# Altium project CycloneMonitor.PrjPCB (part 1 of 2)
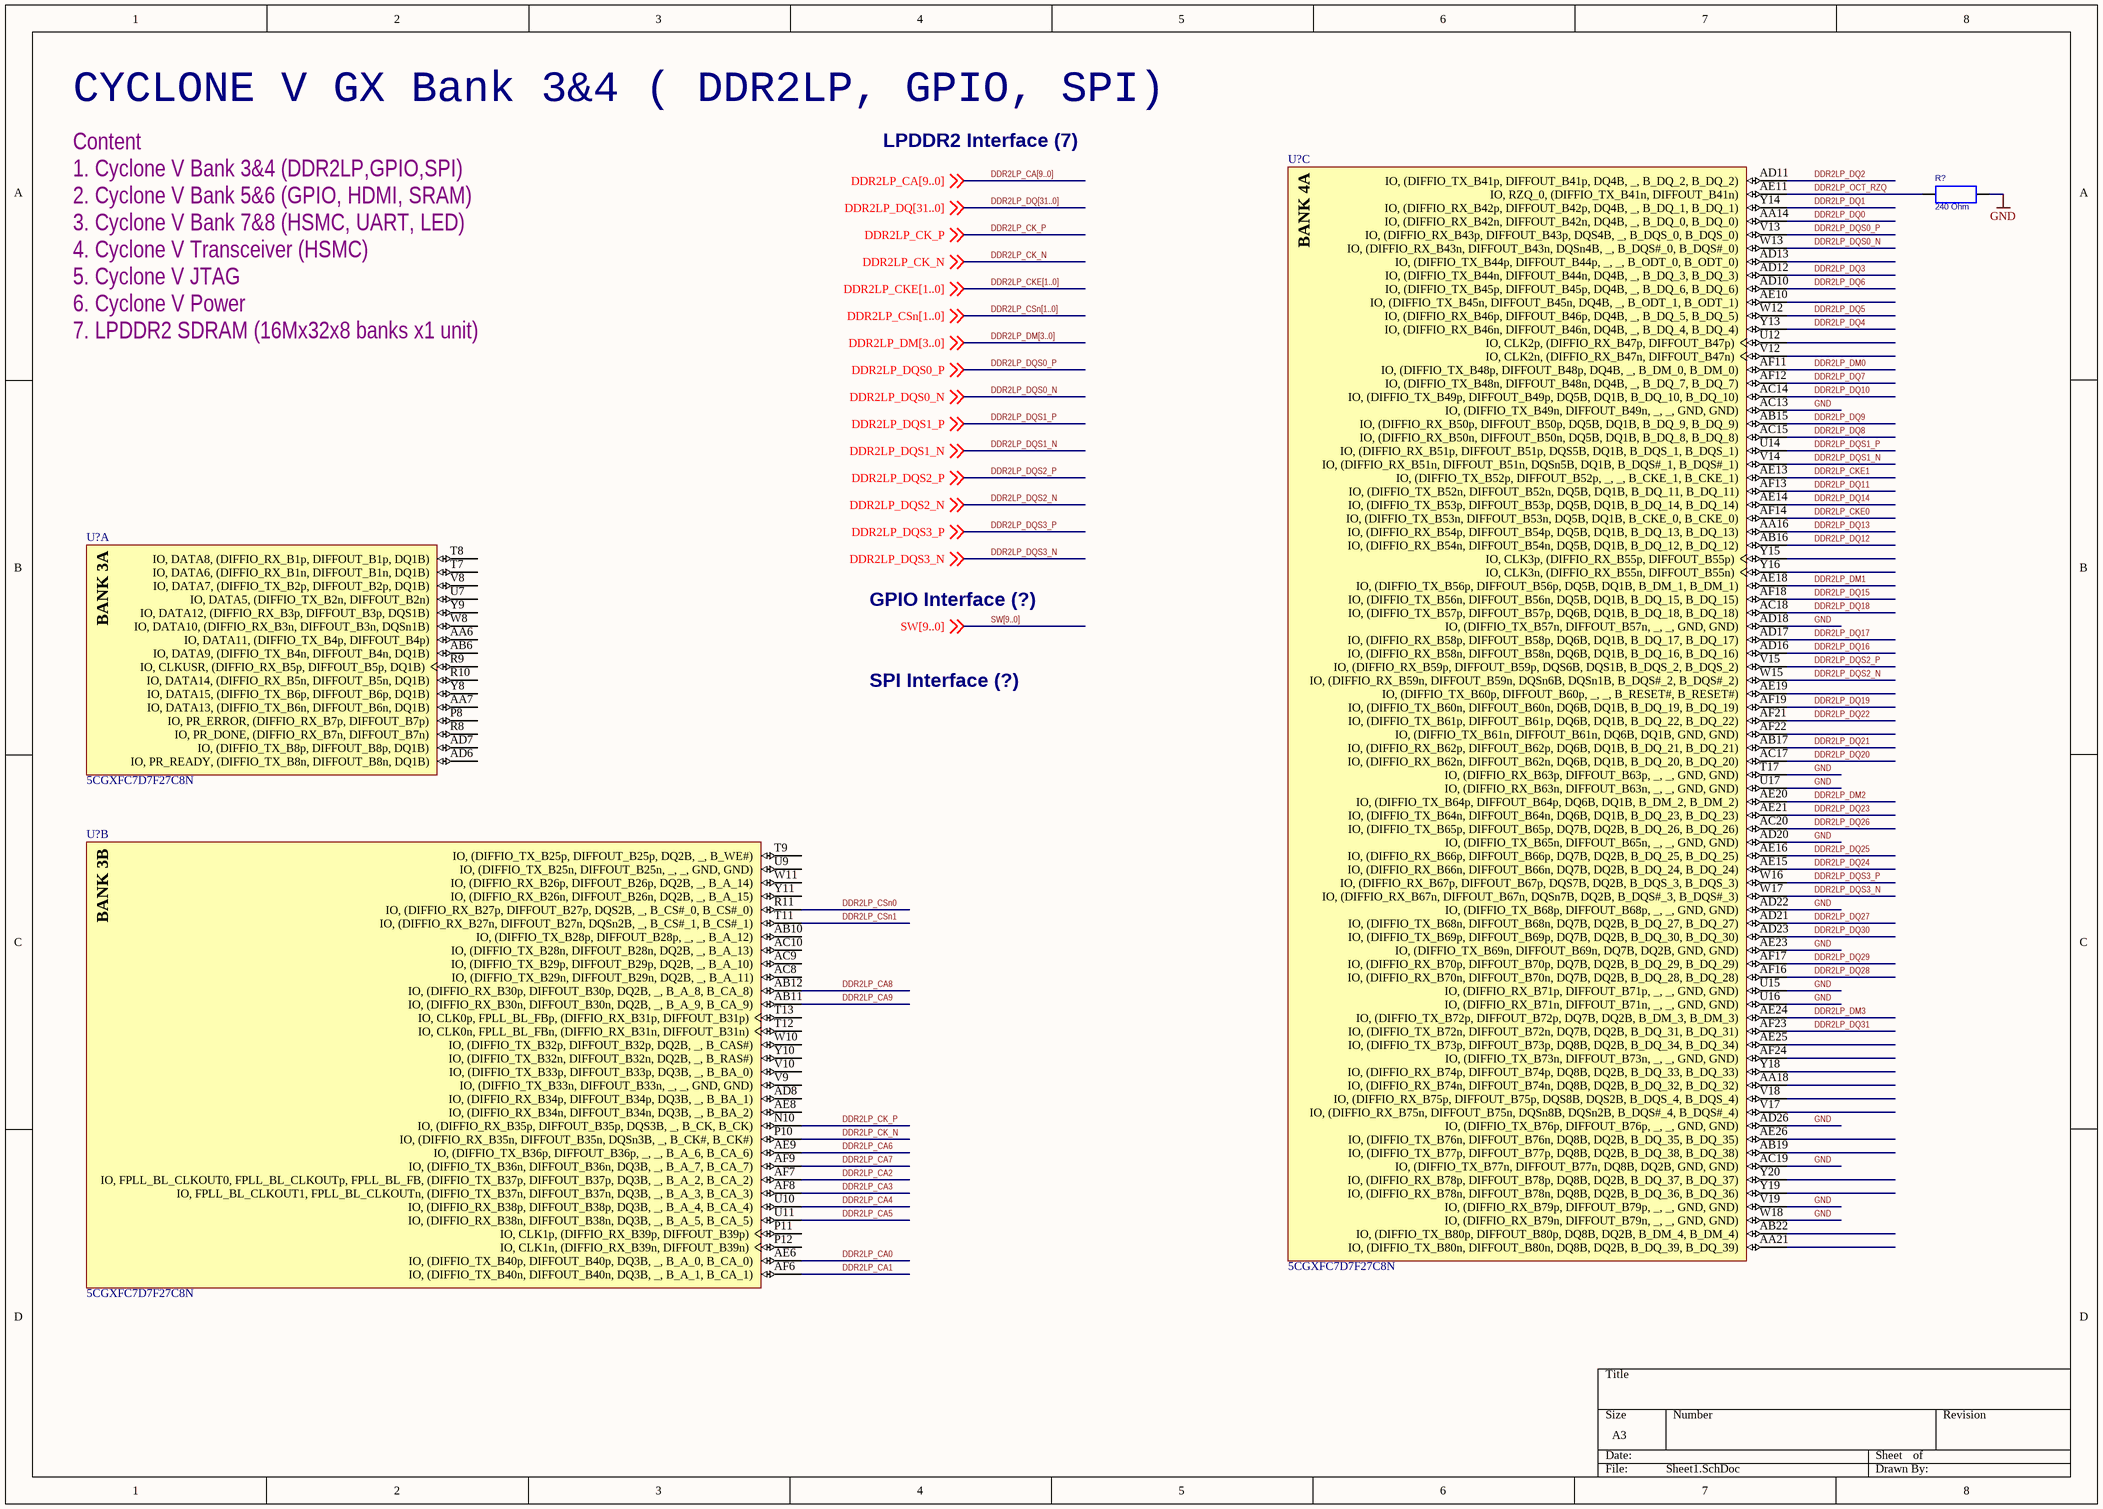
[diagram p0: Sheet1.SchDoc]
7 sheets, 89 parts. Net scope: global (net labels, ports and power ports of the same name join across sheets).
Sheets:
  Sheet1.SchDoc
  Sheet2.SchDoc
  Sheet3.SchDoc
  Sheet4.SchDoc
  Sheet5.SchDoc
  Sheet6.SchDoc
  Sheet7.SchDoc

## Sheet Sheet1.SchDoc
size A3

### Parts
(Parts that share a designator on the sheet are numbered #1, #2 ... from top to bottom, then left to right.)
R?#1  240 Ohm  [RESC1608N]
U?#1  5CGXFC7D7F27C8N  [ALTR-672-FBGA-2000A]  (part C of 15)
U?#2  5CGXFC7D7F27C8N  [ALTR-672-FBGA-2000A]  (part A of 15)
U?#3  5CGXFC7D7F27C8N  [ALTR-672-FBGA-2000A]  (part B of 15)

### Nets
GND: R?#1.2 U?#1.AC13(IO,_(DIFFIO_TX_B49n,_DIFFOUT_B49n,__,__,_GND,_GND)) U?#1.AC19(IO,_(DIFFIO_TX_B77n,_DIFFOUT_B77n,_DQ8B,_DQ2B,_GND,_GND)) U?#1.AD18(IO,_(DIFFIO_TX_B57n,_DIFFOUT_B57n,__,__,_GND,_GND)) U?#1.AD20(IO,_(DIFFIO_TX_B65n,_DIFFOUT_B65n,__,__,_GND,_GND)) U?#1.AD22(IO,_(DIFFIO_TX_B68p,_DIFFOUT_B68p,__,__,_GND,_GND)) U?#1.AD26(IO,_(DIFFIO_TX_B76p,_DIFFOUT_B76p,__,__,_GND,_GND)) U?#1.AE23(IO,_(DIFFIO_TX_B69n,_DIFFOUT_B69n,_DQ7B,_DQ2B,_GND,_GND)) U?#1.T17(IO,_(DIFFIO_RX_B63p,_DIFFOUT_B63p,__,__,_GND,_GND)) U?#1.U15(IO,_(DIFFIO_RX_B71p,_DIFFOUT_B71p,__,__,_GND,_GND)) U?#1.U16(IO,_(DIFFIO_RX_B71n,_DIFFOUT_B71n,__,__,_GND,_GND)) U?#1.U17(IO,_(DIFFIO_RX_B63n,_DIFFOUT_B63n,__,__,_GND,_GND)) U?#1.V19(IO,_(DIFFIO_RX_B79p,_DIFFOUT_B79p,__,__,_GND,_GND)) U?#1.W18(IO,_(DIFFIO_RX_B79n,_DIFFOUT_B79n,__,__,_GND,_GND))
DDR2LP_CA0: U?#3.AE6(IO,_(DIFFIO_TX_B40p,_DIFFOUT_B40p,_DQ3B,__,_B_A_0,_B_CA_0))
DDR2LP_CA1: U?#3.AF6(IO,_(DIFFIO_TX_B40n,_DIFFOUT_B40n,_DQ3B,__,_B_A_1,_B_CA_1))
DDR2LP_CA2: U?#3.AF7(IO,_FPLL_BL_CLKOUT0,_FPLL_BL_CLKOUTp,_FPLL_BL_FB,_(DIFFIO_TX_B37p,_DIFFOUT_B37p,_DQ3B,__,_B_A_2,_B_CA_2))
DDR2LP_CA3: U?#3.AF8(IO,_FPLL_BL_CLKOUT1,_FPLL_BL_CLKOUTn,_(DIFFIO_TX_B37n,_DIFFOUT_B37n,_DQ3B,__,_B_A_3,_B_CA_3))
DDR2LP_CA4: U?#3.U10(IO,_(DIFFIO_RX_B38p,_DIFFOUT_B38p,_DQ3B,__,_B_A_4,_B_CA_4))
DDR2LP_CA5: U?#3.U11(IO,_(DIFFIO_RX_B38n,_DIFFOUT_B38n,_DQ3B,__,_B_A_5,_B_CA_5))
DDR2LP_CA6: U?#3.AE9(IO,_(DIFFIO_TX_B36p,_DIFFOUT_B36p,__,__,_B_A_6,_B_CA_6))
DDR2LP_CA7: U?#3.AF9(IO,_(DIFFIO_TX_B36n,_DIFFOUT_B36n,_DQ3B,__,_B_A_7,_B_CA_7))
DDR2LP_CA8: U?#3.AB12(IO,_(DIFFIO_RX_B30p,_DIFFOUT_B30p,_DQ2B,__,_B_A_8,_B_CA_8))
DDR2LP_CA9: U?#3.AB11(IO,_(DIFFIO_RX_B30n,_DIFFOUT_B30n,_DQ2B,__,_B_A_9,_B_CA_9))
DDR2LP_CK_N: U?#3.P10(IO,_(DIFFIO_RX_B35n,_DIFFOUT_B35n,_DQSn3B,__,_B_CK#,_B_CK#)) ; off-sheet DDR2LP_CK_N
DDR2LP_CK_P: U?#3.N10(IO,_(DIFFIO_RX_B35p,_DIFFOUT_B35p,_DQS3B,__,_B_CK,_B_CK)) ; off-sheet DDR2LP_CK_P
DDR2LP_CKE0: U?#1.AF14(IO,_(DIFFIO_TX_B53n,_DIFFOUT_B53n,_DQ5B,_DQ1B,_B_CKE_0,_B_CKE_0))
DDR2LP_CKE1: U?#1.AE13(IO,_(DIFFIO_TX_B52p,_DIFFOUT_B52p,__,__,_B_CKE_1,_B_CKE_1))
DDR2LP_CSn0: U?#3.R11(IO,_(DIFFIO_RX_B27p,_DIFFOUT_B27p,_DQS2B,__,_B_CS#_0,_B_CS#_0))
DDR2LP_CSn1: U?#3.T11(IO,_(DIFFIO_RX_B27n,_DIFFOUT_B27n,_DQSn2B,__,_B_CS#_1,_B_CS#_1))
DDR2LP_DM0: U?#1.AF11(IO,_(DIFFIO_TX_B48p,_DIFFOUT_B48p,_DQ4B,__,_B_DM_0,_B_DM_0))
DDR2LP_DM1: U?#1.AE18(IO,_(DIFFIO_TX_B56p,_DIFFOUT_B56p,_DQ5B,_DQ1B,_B_DM_1,_B_DM_1))
DDR2LP_DM2: U?#1.AE20(IO,_(DIFFIO_TX_B64p,_DIFFOUT_B64p,_DQ6B,_DQ1B,_B_DM_2,_B_DM_2))
DDR2LP_DM3: U?#1.AE24(IO,_(DIFFIO_TX_B72p,_DIFFOUT_B72p,_DQ7B,_DQ2B,_B_DM_3,_B_DM_3))
DDR2LP_DQ0: U?#1.AA14(IO,_(DIFFIO_RX_B42n,_DIFFOUT_B42n,_DQ4B,__,_B_DQ_0,_B_DQ_0))
DDR2LP_DQ1: U?#1.Y14(IO,_(DIFFIO_RX_B42p,_DIFFOUT_B42p,_DQ4B,__,_B_DQ_1,_B_DQ_1))
DDR2LP_DQ2: U?#1.AD11(IO,_(DIFFIO_TX_B41p,_DIFFOUT_B41p,_DQ4B,__,_B_DQ_2,_B_DQ_2))
DDR2LP_DQ3: U?#1.AD12(IO,_(DIFFIO_TX_B44n,_DIFFOUT_B44n,_DQ4B,__,_B_DQ_3,_B_DQ_3))
DDR2LP_DQ4: U?#1.Y13(IO,_(DIFFIO_RX_B46n,_DIFFOUT_B46n,_DQ4B,__,_B_DQ_4,_B_DQ_4))
DDR2LP_DQ5: U?#1.W12(IO,_(DIFFIO_RX_B46p,_DIFFOUT_B46p,_DQ4B,__,_B_DQ_5,_B_DQ_5))
DDR2LP_DQ6: U?#1.AD10(IO,_(DIFFIO_TX_B45p,_DIFFOUT_B45p,_DQ4B,__,_B_DQ_6,_B_DQ_6))
DDR2LP_DQ7: U?#1.AF12(IO,_(DIFFIO_TX_B48n,_DIFFOUT_B48n,_DQ4B,__,_B_DQ_7,_B_DQ_7))
DDR2LP_DQ8: U?#1.AC15(IO,_(DIFFIO_RX_B50n,_DIFFOUT_B50n,_DQ5B,_DQ1B,_B_DQ_8,_B_DQ_8))
DDR2LP_DQ9: U?#1.AB15(IO,_(DIFFIO_RX_B50p,_DIFFOUT_B50p,_DQ5B,_DQ1B,_B_DQ_9,_B_DQ_9))
DDR2LP_DQ10: U?#1.AC14(IO,_(DIFFIO_TX_B49p,_DIFFOUT_B49p,_DQ5B,_DQ1B,_B_DQ_10,_B_DQ_10))
DDR2LP_DQ11: U?#1.AF13(IO,_(DIFFIO_TX_B52n,_DIFFOUT_B52n,_DQ5B,_DQ1B,_B_DQ_11,_B_DQ_11))
DDR2LP_DQ12: U?#1.AB16(IO,_(DIFFIO_RX_B54n,_DIFFOUT_B54n,_DQ5B,_DQ1B,_B_DQ_12,_B_DQ_12))
DDR2LP_DQ13: U?#1.AA16(IO,_(DIFFIO_RX_B54p,_DIFFOUT_B54p,_DQ5B,_DQ1B,_B_DQ_13,_B_DQ_13))
DDR2LP_DQ14: U?#1.AE14(IO,_(DIFFIO_TX_B53p,_DIFFOUT_B53p,_DQ5B,_DQ1B,_B_DQ_14,_B_DQ_14))
DDR2LP_DQ15: U?#1.AF18(IO,_(DIFFIO_TX_B56n,_DIFFOUT_B56n,_DQ5B,_DQ1B,_B_DQ_15,_B_DQ_15))
DDR2LP_DQ16: U?#1.AD16(IO,_(DIFFIO_RX_B58n,_DIFFOUT_B58n,_DQ6B,_DQ1B,_B_DQ_16,_B_DQ_16))
DDR2LP_DQ17: U?#1.AD17(IO,_(DIFFIO_RX_B58p,_DIFFOUT_B58p,_DQ6B,_DQ1B,_B_DQ_17,_B_DQ_17))
DDR2LP_DQ18: U?#1.AC18(IO,_(DIFFIO_TX_B57p,_DIFFOUT_B57p,_DQ6B,_DQ1B,_B_DQ_18,_B_DQ_18))
DDR2LP_DQ19: U?#1.AF19(IO,_(DIFFIO_TX_B60n,_DIFFOUT_B60n,_DQ6B,_DQ1B,_B_DQ_19,_B_DQ_19))
DDR2LP_DQ20: U?#1.AC17(IO,_(DIFFIO_RX_B62n,_DIFFOUT_B62n,_DQ6B,_DQ1B,_B_DQ_20,_B_DQ_20))
DDR2LP_DQ21: U?#1.AB17(IO,_(DIFFIO_RX_B62p,_DIFFOUT_B62p,_DQ6B,_DQ1B,_B_DQ_21,_B_DQ_21))
DDR2LP_DQ22: U?#1.AF21(IO,_(DIFFIO_TX_B61p,_DIFFOUT_B61p,_DQ6B,_DQ1B,_B_DQ_22,_B_DQ_22))
DDR2LP_DQ23: U?#1.AE21(IO,_(DIFFIO_TX_B64n,_DIFFOUT_B64n,_DQ6B,_DQ1B,_B_DQ_23,_B_DQ_23))
DDR2LP_DQ24: U?#1.AE15(IO,_(DIFFIO_RX_B66n,_DIFFOUT_B66n,_DQ7B,_DQ2B,_B_DQ_24,_B_DQ_24))
DDR2LP_DQ25: U?#1.AE16(IO,_(DIFFIO_RX_B66p,_DIFFOUT_B66p,_DQ7B,_DQ2B,_B_DQ_25,_B_DQ_25))
DDR2LP_DQ26: U?#1.AC20(IO,_(DIFFIO_TX_B65p,_DIFFOUT_B65p,_DQ7B,_DQ2B,_B_DQ_26,_B_DQ_26))
DDR2LP_DQ27: U?#1.AD21(IO,_(DIFFIO_TX_B68n,_DIFFOUT_B68n,_DQ7B,_DQ2B,_B_DQ_27,_B_DQ_27))
DDR2LP_DQ28: U?#1.AF16(IO,_(DIFFIO_RX_B70n,_DIFFOUT_B70n,_DQ7B,_DQ2B,_B_DQ_28,_B_DQ_28))
DDR2LP_DQ29: U?#1.AF17(IO,_(DIFFIO_RX_B70p,_DIFFOUT_B70p,_DQ7B,_DQ2B,_B_DQ_29,_B_DQ_29))
DDR2LP_DQ30: U?#1.AD23(IO,_(DIFFIO_TX_B69p,_DIFFOUT_B69p,_DQ7B,_DQ2B,_B_DQ_30,_B_DQ_30))
DDR2LP_DQ31: U?#1.AF23(IO,_(DIFFIO_TX_B72n,_DIFFOUT_B72n,_DQ7B,_DQ2B,_B_DQ_31,_B_DQ_31))
DDR2LP_DQS0_N: U?#1.W13(IO,_(DIFFIO_RX_B43n,_DIFFOUT_B43n,_DQSn4B,__,_B_DQS#_0,_B_DQS#_0)) ; off-sheet DDR2LP_DQS0_N
DDR2LP_DQS0_P: U?#1.V13(IO,_(DIFFIO_RX_B43p,_DIFFOUT_B43p,_DQS4B,__,_B_DQS_0,_B_DQS_0)) ; off-sheet DDR2LP_DQS0_P
DDR2LP_DQS1_N: U?#1.V14(IO,_(DIFFIO_RX_B51n,_DIFFOUT_B51n,_DQSn5B,_DQ1B,_B_DQS#_1,_B_DQS#_1)) ; off-sheet DDR2LP_DQS1_N
DDR2LP_DQS1_P: U?#1.U14(IO,_(DIFFIO_RX_B51p,_DIFFOUT_B51p,_DQS5B,_DQ1B,_B_DQS_1,_B_DQS_1)) ; off-sheet DDR2LP_DQS1_P
DDR2LP_DQS2_N: U?#1.W15(IO,_(DIFFIO_RX_B59n,_DIFFOUT_B59n,_DQSn6B,_DQSn1B,_B_DQS#_2,_B_DQS#_2)) ; off-sheet DDR2LP_DQS2_N
DDR2LP_DQS2_P: U?#1.V15(IO,_(DIFFIO_RX_B59p,_DIFFOUT_B59p,_DQS6B,_DQS1B,_B_DQS_2,_B_DQS_2)) ; off-sheet DDR2LP_DQS2_P
DDR2LP_DQS3_N: U?#1.W17(IO,_(DIFFIO_RX_B67n,_DIFFOUT_B67n,_DQSn7B,_DQ2B,_B_DQS#_3,_B_DQS#_3)) ; off-sheet DDR2LP_DQS3_N
DDR2LP_DQS3_P: U?#1.W16(IO,_(DIFFIO_RX_B67p,_DIFFOUT_B67p,_DQS7B,_DQ2B,_B_DQS_3,_B_DQS_3)) ; off-sheet DDR2LP_DQS3_P
DDR2LP_OCT_RZQ: R?#1.1 U?#1.AE11(IO,_RZQ_0,_(DIFFIO_TX_B41n,_DIFFOUT_B41n))

Not connected (* = marked no-connect by the designer): U?#1 AA18(IO,_(DIFFIO_RX_B74n,_DIFFOUT_B74n,_DQ8B,_DQ2B,_B_DQ_32,_B_DQ_32)) AA21(IO,_(DIFFIO_TX_B80n,_DIFFOUT_B80n,_DQ8B,_DQ2B,_B_DQ_39,_B_DQ_39)) AB19(IO,_(DIFFIO_TX_B77p,_DIFFOUT_B77p,_DQ8B,_DQ2B,_B_DQ_38,_B_DQ_38)) AB22(IO,_(DIFFIO_TX_B80p,_DIFFOUT_B80p,_DQ8B,_DQ2B,_B_DM_4,_B_DM_4)) AD13(IO,_(DIFFIO_TX_B44p,_DIFFOUT_B44p,__,__,_B_ODT_0,_B_ODT_0)) AE10(IO,_(DIFFIO_TX_B45n,_DIFFOUT_B45n,_DQ4B,__,_B_ODT_1,_B_ODT_1)) AE19(IO,_(DIFFIO_TX_B60p,_DIFFOUT_B60p,__,__,_B_RESET#,_B_RESET#)) AE25(IO,_(DIFFIO_TX_B73p,_DIFFOUT_B73p,_DQ8B,_DQ2B,_B_DQ_34,_B_DQ_34)) AE26(IO,_(DIFFIO_TX_B76n,_DIFFOUT_B76n,_DQ8B,_DQ2B,_B_DQ_35,_B_DQ_35)) AF22(IO,_(DIFFIO_TX_B61n,_DIFFOUT_B61n,_DQ6B,_DQ1B,_GND,_GND)) AF24(IO,_(DIFFIO_TX_B73n,_DIFFOUT_B73n,__,__,_GND,_GND)) U12(IO,_CLK2p,_(DIFFIO_RX_B47p,_DIFFOUT_B47p)) V12(IO,_CLK2n,_(DIFFIO_RX_B47n,_DIFFOUT_B47n)) V17(IO,_(DIFFIO_RX_B75n,_DIFFOUT_B75n,_DQSn8B,_DQSn2B,_B_DQS#_4,_B_DQS#_4)) V18(IO,_(DIFFIO_RX_B75p,_DIFFOUT_B75p,_DQS8B,_DQS2B,_B_DQS_4,_B_DQS_4)) Y15(IO,_CLK3p,_(DIFFIO_RX_B55p,_DIFFOUT_B55p)) Y16(IO,_CLK3n,_(DIFFIO_RX_B55n,_DIFFOUT_B55n)) Y18(IO,_(DIFFIO_RX_B74p,_DIFFOUT_B74p,_DQ8B,_DQ2B,_B_DQ_33,_B_DQ_33)) Y19(IO,_(DIFFIO_RX_B78n,_DIFFOUT_B78n,_DQ8B,_DQ2B,_B_DQ_36,_B_DQ_36)) Y20(IO,_(DIFFIO_RX_B78p,_DIFFOUT_B78p,_DQ8B,_DQ2B,_B_DQ_37,_B_DQ_37)); U?#2 AA6(IO,_DATA11,_(DIFFIO_TX_B4p,_DIFFOUT_B4p)) AA7(IO,_DATA13,_(DIFFIO_TX_B6n,_DIFFOUT_B6n,_DQ1B)) AB6(IO,_DATA9,_(DIFFIO_TX_B4n,_DIFFOUT_B4n,_DQ1B)) AD6(IO,_PR_READY,_(DIFFIO_TX_B8n,_DIFFOUT_B8n,_DQ1B)) AD7(IO,_(DIFFIO_TX_B8p,_DIFFOUT_B8p,_DQ1B)) P8(IO,_PR_ERROR,_(DIFFIO_RX_B7p,_DIFFOUT_B7p)) R8(IO,_PR_DONE,_(DIFFIO_RX_B7n,_DIFFOUT_B7n)) R9(IO,_CLKUSR,_(DIFFIO_RX_B5p,_DIFFOUT_B5p,_DQ1B)) R10(IO,_DATA14,_(DIFFIO_RX_B5n,_DIFFOUT_B5n,_DQ1B)) T7(IO,_DATA6,_(DIFFIO_RX_B1n,_DIFFOUT_B1n,_DQ1B)) T8(IO,_DATA8,_(DIFFIO_RX_B1p,_DIFFOUT_B1p,_DQ1B)) U7(IO,_DATA5,_(DIFFIO_TX_B2n,_DIFFOUT_B2n)) V8(IO,_DATA7,_(DIFFIO_TX_B2p,_DIFFOUT_B2p,_DQ1B)) W8(IO,_DATA10,_(DIFFIO_RX_B3n,_DIFFOUT_B3n,_DQSn1B)) Y8(IO,_DATA15,_(DIFFIO_TX_B6p,_DIFFOUT_B6p,_DQ1B)) Y9(IO,_DATA12,_(DIFFIO_RX_B3p,_DIFFOUT_B3p,_DQS1B)); U?#3 AB10(IO,_(DIFFIO_TX_B28p,_DIFFOUT_B28p,__,__,_B_A_12)) AC8(IO,_(DIFFIO_TX_B29n,_DIFFOUT_B29n,_DQ2B,__,_B_A_11)) AC9(IO,_(DIFFIO_TX_B29p,_DIFFOUT_B29p,_DQ2B,__,_B_A_10)) AC10(IO,_(DIFFIO_TX_B28n,_DIFFOUT_B28n,_DQ2B,__,_B_A_13)) AD8(IO,_(DIFFIO_RX_B34p,_DIFFOUT_B34p,_DQ3B,__,_B_BA_1)) AE8(IO,_(DIFFIO_RX_B34n,_DIFFOUT_B34n,_DQ3B,__,_B_BA_2)) P11(IO,_CLK1p,_(DIFFIO_RX_B39p,_DIFFOUT_B39p)) P12(IO,_CLK1n,_(DIFFIO_RX_B39n,_DIFFOUT_B39n)) T9(IO,_(DIFFIO_TX_B25p,_DIFFOUT_B25p,_DQ2B,__,_B_WE#)) T12(IO,_CLK0n,_FPLL_BL_FBn,_(DIFFIO_RX_B31n,_DIFFOUT_B31n)) T13(IO,_CLK0p,_FPLL_BL_FBp,_(DIFFIO_RX_B31p,_DIFFOUT_B31p)) U9(IO,_(DIFFIO_TX_B25n,_DIFFOUT_B25n,__,__,_GND,_GND)) V9(IO,_(DIFFIO_TX_B33n,_DIFFOUT_B33n,__,__,_GND,_GND)) V10(IO,_(DIFFIO_TX_B33p,_DIFFOUT_B33p,_DQ3B,__,_B_BA_0)) W10(IO,_(DIFFIO_TX_B32p,_DIFFOUT_B32p,_DQ2B,__,_B_CAS#)) W11(IO,_(DIFFIO_RX_B26p,_DIFFOUT_B26p,_DQ2B,__,_B_A_14)) Y10(IO,_(DIFFIO_TX_B32n,_DIFFOUT_B32n,_DQ2B,__,_B_RAS#)) Y11(IO,_(DIFFIO_RX_B26n,_DIFFOUT_B26n,_DQ2B,__,_B_A_15))

### Buses and harness runs
bus DDR2LP_CA[9..0]
bus DDR2LP_CKE[1..0]
bus DDR2LP_CSn[1..0]
bus DDR2LP_DM[3..0]
bus DDR2LP_DQ[31..0]
bus SW[9..0]

### Notes on the sheet
- CYCLONE V GX Bank 3&4 ( DDR2LP, GPIO, SPI)
- LPDDR2 Interface (7)
- (near U?#2) Content
  1. Cyclone V Bank 3&4 (DDR2LP,GPIO,SPI)
  2. Cyclone V Bank 5&6 (GPIO, HDMI, SRAM)
  3. Cyclone V Bank 7&8 (HSMC, UART, LED)
  4. Cyclone V Transceiver (HSMC)
  5. Cyclone V JTAG
  6. Cyclone V Power
  7. LPDDR2 SDRAM (16Mx32x8 banks x1 unit)
- GPIO Interface (?)
- SPI Interface (?)
- (in symbol 5CGXFC7D7F27C8N, part A) BANK 3A
- (in symbol 5CGXFC7D7F27C8N, part B) BANK 3B
- (in symbol 5CGXFC7D7F27C8N, part C) BANK 4A

### Library data of the parts
R?#1 = RC0603: Oper. Temp. Range: -55C to 125C; RoHS: Yes; Package: 0603
U?#1-U?#3 = 5CGXFC7D7F27C8N: Cyclone V GX Family FPGA, 1.07 to 1.13 V Supply, 336 I/O Pins, 7 PLLs, 672-Pin FBGA, Speed Grade 8, Commercial Grade, RoHS Compliant; Manufacturer: Altera; GPIO: 336; Logic Elements (LE) (K): 149.5; Speed Grade: 8; DatasheetVersion: Rev. 3.1; PackageReference: 672-FBGA-2000A; PackageDescription: 672-Pin FineLine Ball-Grid Array (FBGA), Body 27 x 27 mm, Pitch 1 mm; Supplier 1: Digi-Key; Supplier Part Number 1: 544-2773-ND; Supplier 2: Mouser; Supplier Part Number 2: 989-5CGXFC7D7F27C8N; Device Group: 5CGXFC7; RoHS: RoHS Compliant; Subcategory: Cyclone V GX; Voltage Supply: 1.07 to 1.13 V; Mounting Technology: Surface Mount; Code_JEDEC: MS-034-AAL-1; PartNumber: 5CGXFC7D7F27C8N; ComponentLink1Description: Manufacturer URL; ComponentLink1URL: http://www.altera.com; ComponentLink2Description: Datasheet; ComponentLink2URL: http://www.altera.com/literature/hb/cyclone-v/cv_51002.pdf; ComponentLink3Description: Package Specification; ComponentLink3URL: http://www.altera.com/devicepackaging/04R00427-01.pdf; ComponentLink4Description: Device Handbook URL; ComponentLink4URL: http://www.altera.com/literature/hb/cyclone-v/cyclone5_handbook.pdf; ComponentLink5Description: Device Overview URL; ComponentLink5URL: http://www.altera.com/literature/hb/cyclone-v/cv_51001.pdf; ComponentLink6Description: Device Pin-Out URL; ComponentLink6URL: http://www.altera.com/literature/dp/cyclone-v/1.txt; ComponentLink7Description: Product URL; ComponentLink7URL: http://www.buyaltera.com/scripts/partsearch.dll?Detail&name=5CGXFC7D7F27C8N-ND

## Sheet Sheet2.SchDoc
size A3
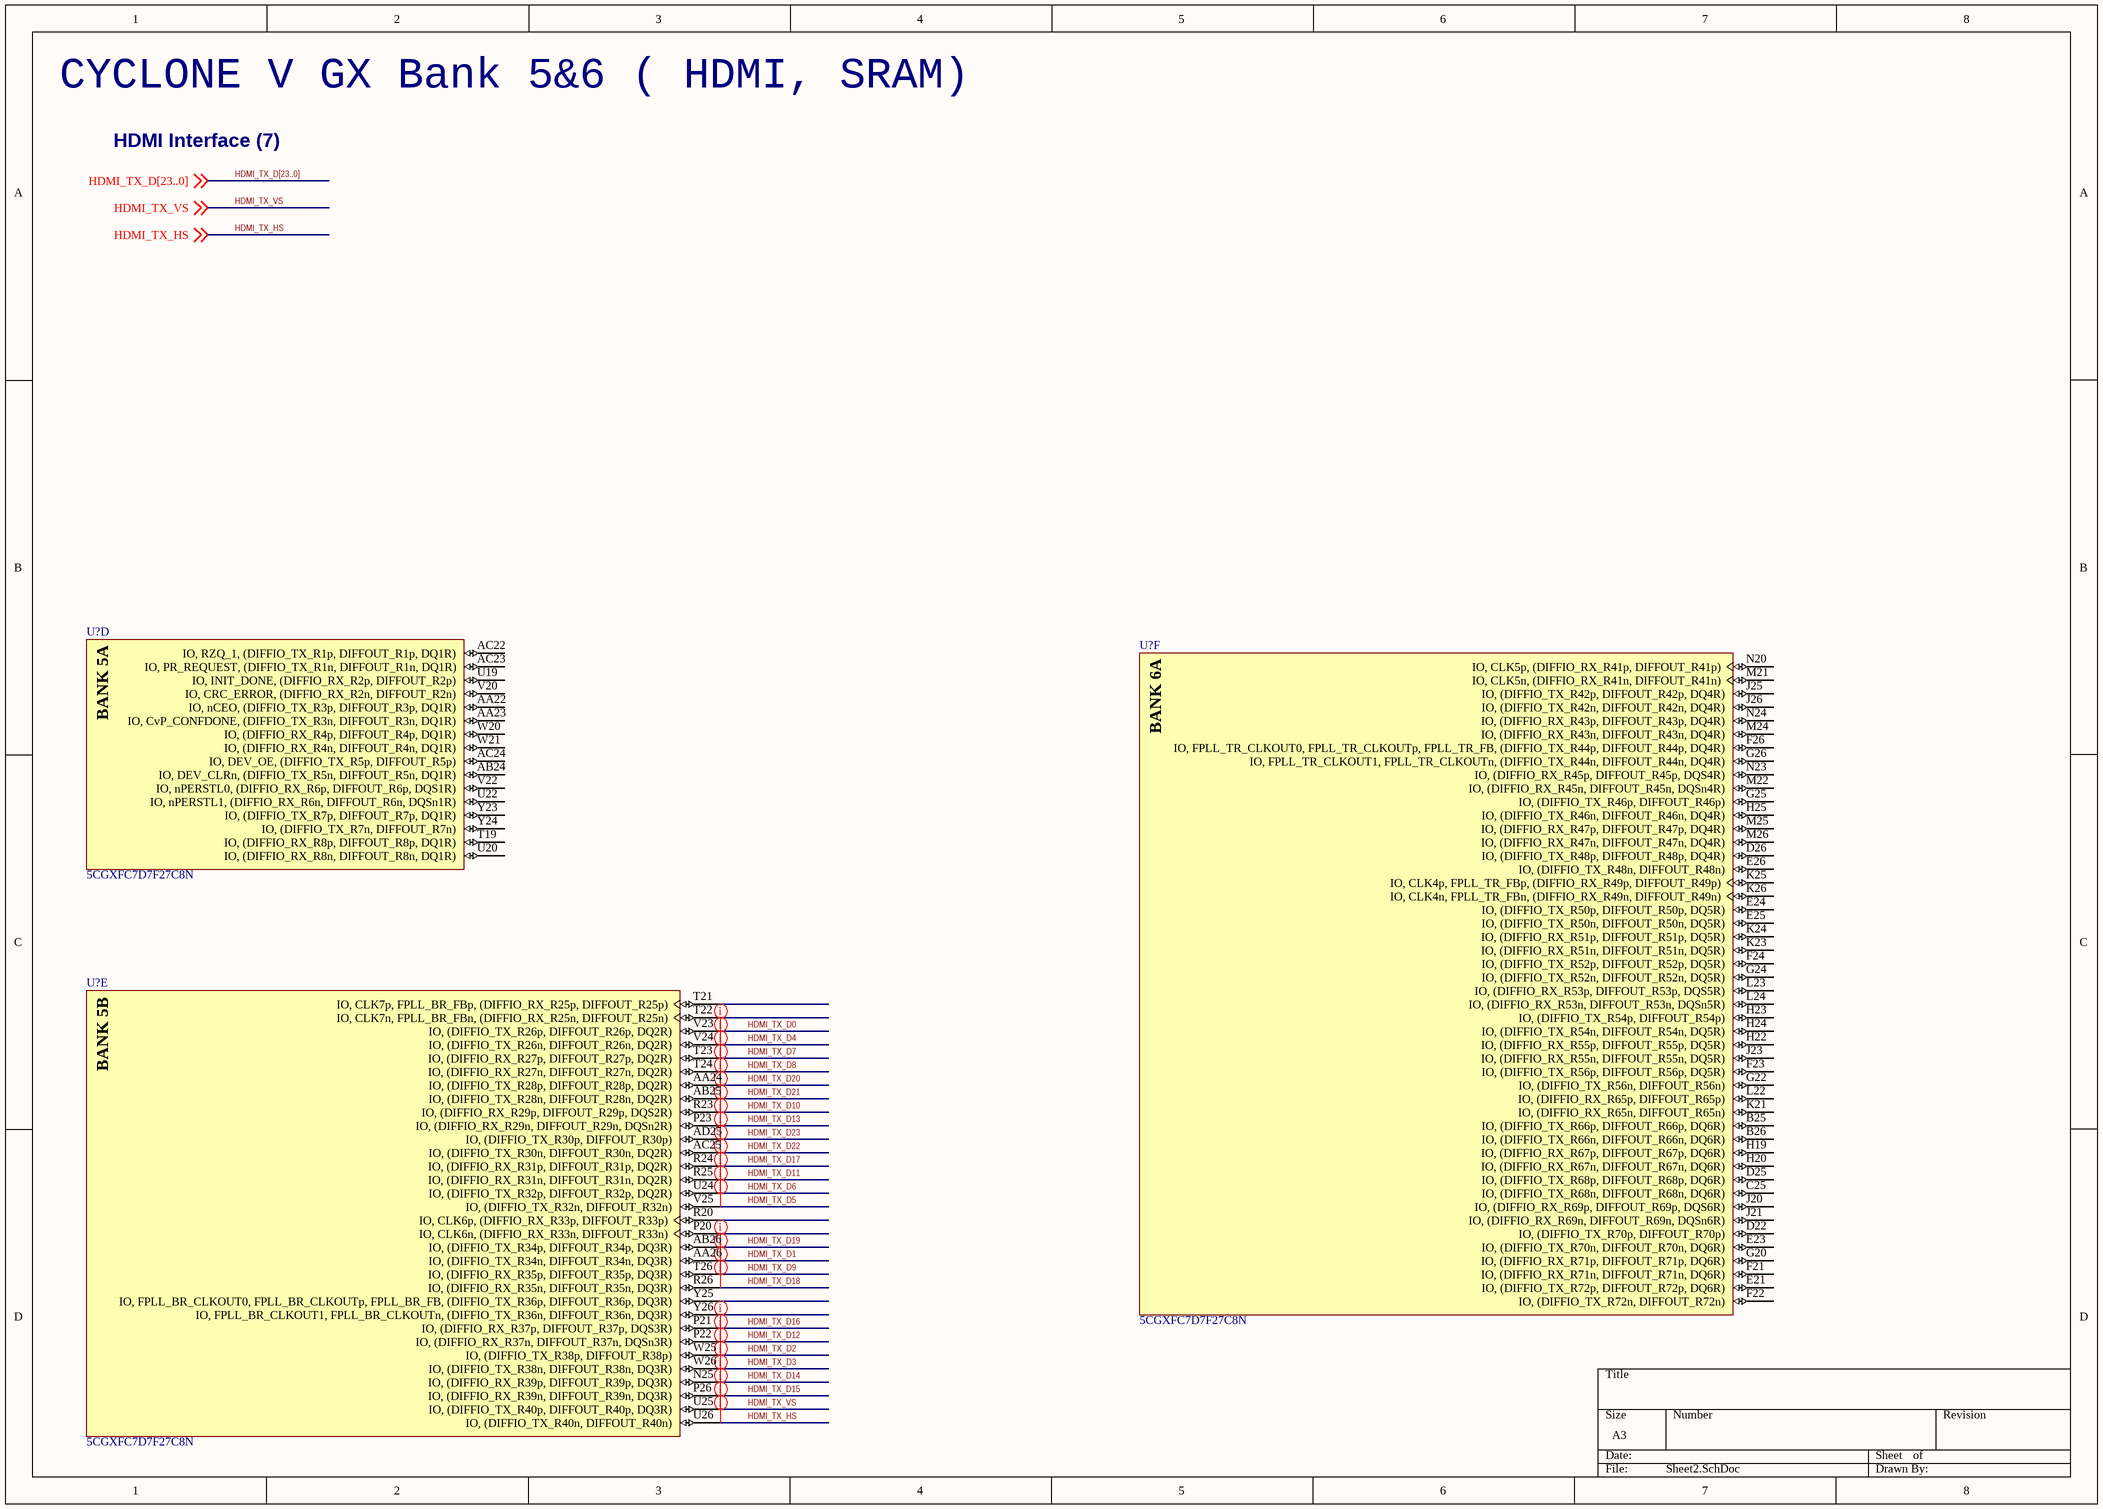
[diagram p1: Sheet2.SchDoc]

### Parts
(Parts that share a designator on the sheet are numbered #1, #2 ... from top to bottom, then left to right.)
U?#4  5CGXFC7D7F27C8N  [ALTR-672-FBGA-2000A]  (part D of 15)
U?#5  5CGXFC7D7F27C8N  [ALTR-672-FBGA-2000A]  (part F of 15)
U?#6  5CGXFC7D7F27C8N  [ALTR-672-FBGA-2000A]  (part E of 15)

### Nets
HDMI_TX_D0: U?#6.V23(IO,_(DIFFIO_TX_R26p,_DIFFOUT_R26p,_DQ2R))
HDMI_TX_D1: U?#6.AA26(IO,_(DIFFIO_TX_R34n,_DIFFOUT_R34n,_DQ3R))
HDMI_TX_D2: U?#6.W25(IO,_(DIFFIO_TX_R38p,_DIFFOUT_R38p))
HDMI_TX_D3: U?#6.W26(IO,_(DIFFIO_TX_R38n,_DIFFOUT_R38n,_DQ3R))
HDMI_TX_D4: U?#6.V24(IO,_(DIFFIO_TX_R26n,_DIFFOUT_R26n,_DQ2R))
HDMI_TX_D5: U?#6.V25(IO,_(DIFFIO_TX_R32n,_DIFFOUT_R32n))
HDMI_TX_D6: U?#6.U24(IO,_(DIFFIO_TX_R32p,_DIFFOUT_R32p,_DQ2R))
HDMI_TX_D7: U?#6.T23(IO,_(DIFFIO_RX_R27p,_DIFFOUT_R27p,_DQ2R))
HDMI_TX_D8: U?#6.T24(IO,_(DIFFIO_RX_R27n,_DIFFOUT_R27n,_DQ2R))
HDMI_TX_D9: U?#6.T26(IO,_(DIFFIO_RX_R35p,_DIFFOUT_R35p,_DQ3R))
HDMI_TX_D10: U?#6.R23(IO,_(DIFFIO_RX_R29p,_DIFFOUT_R29p,_DQS2R))
HDMI_TX_D11: U?#6.R25(IO,_(DIFFIO_RX_R31n,_DIFFOUT_R31n,_DQ2R))
HDMI_TX_D12: U?#6.P22(IO,_(DIFFIO_RX_R37n,_DIFFOUT_R37n,_DQSn3R))
HDMI_TX_D13: U?#6.P23(IO,_(DIFFIO_RX_R29n,_DIFFOUT_R29n,_DQSn2R))
HDMI_TX_D14: U?#6.N25(IO,_(DIFFIO_RX_R39p,_DIFFOUT_R39p,_DQ3R))
HDMI_TX_D15: U?#6.P26(IO,_(DIFFIO_RX_R39n,_DIFFOUT_R39n,_DQ3R))
HDMI_TX_D16: U?#6.P21(IO,_(DIFFIO_RX_R37p,_DIFFOUT_R37p,_DQS3R))
HDMI_TX_D17: U?#6.R24(IO,_(DIFFIO_RX_R31p,_DIFFOUT_R31p,_DQ2R))
HDMI_TX_D18: U?#6.R26(IO,_(DIFFIO_RX_R35n,_DIFFOUT_R35n,_DQ3R))
HDMI_TX_D19: U?#6.AB26(IO,_(DIFFIO_TX_R34p,_DIFFOUT_R34p,_DQ3R))
HDMI_TX_D20: U?#6.AA24(IO,_(DIFFIO_TX_R28p,_DIFFOUT_R28p,_DQ2R))
HDMI_TX_D21: U?#6.AB25(IO,_(DIFFIO_TX_R28n,_DIFFOUT_R28n,_DQ2R))
HDMI_TX_D22: U?#6.AC25(IO,_(DIFFIO_TX_R30n,_DIFFOUT_R30n,_DQ2R))
HDMI_TX_D23: U?#6.AD25(IO,_(DIFFIO_TX_R30p,_DIFFOUT_R30p))
HDMI_TX_HS: U?#6.U26(IO,_(DIFFIO_TX_R40n,_DIFFOUT_R40n)) ; off-sheet HDMI_TX_HS
HDMI_TX_VS: U?#6.U25(IO,_(DIFFIO_TX_R40p,_DIFFOUT_R40p,_DQ3R)) ; off-sheet HDMI_TX_VS

Not connected (* = marked no-connect by the designer): U?#4 AA22(IO,_nCEO,_(DIFFIO_TX_R3p,_DIFFOUT_R3p,_DQ1R)) AA23(IO,_CvP_CONFDONE,_(DIFFIO_TX_R3n,_DIFFOUT_R3n,_DQ1R)) AB24(IO,_DEV_CLRn,_(DIFFIO_TX_R5n,_DIFFOUT_R5n,_DQ1R)) AC22(IO,_RZQ_1,_(DIFFIO_TX_R1p,_DIFFOUT_R1p,_DQ1R)) AC23(IO,_PR_REQUEST,_(DIFFIO_TX_R1n,_DIFFOUT_R1n,_DQ1R)) AC24(IO,_DEV_OE,_(DIFFIO_TX_R5p,_DIFFOUT_R5p)) T19(IO,_(DIFFIO_RX_R8p,_DIFFOUT_R8p,_DQ1R)) U19(IO,_INIT_DONE,_(DIFFIO_RX_R2p,_DIFFOUT_R2p)) U20(IO,_(DIFFIO_RX_R8n,_DIFFOUT_R8n,_DQ1R)) U22(IO,_nPERSTL1,_(DIFFIO_RX_R6n,_DIFFOUT_R6n,_DQSn1R)) V20(IO,_CRC_ERROR,_(DIFFIO_RX_R2n,_DIFFOUT_R2n)) V22(IO,_nPERSTL0,_(DIFFIO_RX_R6p,_DIFFOUT_R6p,_DQS1R)) W20(IO,_(DIFFIO_RX_R4p,_DIFFOUT_R4p,_DQ1R)) W21(IO,_(DIFFIO_RX_R4n,_DIFFOUT_R4n,_DQ1R)) Y23(IO,_(DIFFIO_TX_R7p,_DIFFOUT_R7p,_DQ1R)) Y24(IO,_(DIFFIO_TX_R7n,_DIFFOUT_R7n)); U?#5 B25(IO,_(DIFFIO_TX_R66p,_DIFFOUT_R66p,_DQ6R)) B26(IO,_(DIFFIO_TX_R66n,_DIFFOUT_R66n,_DQ6R)) C25(IO,_(DIFFIO_TX_R68n,_DIFFOUT_R68n,_DQ6R)) D22(IO,_(DIFFIO_TX_R70p,_DIFFOUT_R70p)) D25(IO,_(DIFFIO_TX_R68p,_DIFFOUT_R68p,_DQ6R)) D26(IO,_(DIFFIO_TX_R48p,_DIFFOUT_R48p,_DQ4R)) E21(IO,_(DIFFIO_TX_R72p,_DIFFOUT_R72p,_DQ6R)) E23(IO,_(DIFFIO_TX_R70n,_DIFFOUT_R70n,_DQ6R)) E24(IO,_(DIFFIO_TX_R50p,_DIFFOUT_R50p,_DQ5R)) E25(IO,_(DIFFIO_TX_R50n,_DIFFOUT_R50n,_DQ5R)) E26(IO,_(DIFFIO_TX_R48n,_DIFFOUT_R48n)) F21(IO,_(DIFFIO_RX_R71n,_DIFFOUT_R71n,_DQ6R)) F22(IO,_(DIFFIO_TX_R72n,_DIFFOUT_R72n)) F23(IO,_(DIFFIO_TX_R56p,_DIFFOUT_R56p,_DQ5R)) F24(IO,_(DIFFIO_TX_R52p,_DIFFOUT_R52p,_DQ5R)) F26(IO,_FPLL_TR_CLKOUT0,_FPLL_TR_CLKOUTp,_FPLL_TR_FB,_(DIFFIO_TX_R44p,_DIFFOUT_R44p,_DQ4R)) G20(IO,_(DIFFIO_RX_R71p,_DIFFOUT_R71p,_DQ6R)) G22(IO,_(DIFFIO_TX_R56n,_DIFFOUT_R56n)) G24(IO,_(DIFFIO_TX_R52n,_DIFFOUT_R52n,_DQ5R)) G25(IO,_(DIFFIO_TX_R46p,_DIFFOUT_R46p)) G26(IO,_FPLL_TR_CLKOUT1,_FPLL_TR_CLKOUTn,_(DIFFIO_TX_R44n,_DIFFOUT_R44n,_DQ4R)) H19(IO,_(DIFFIO_RX_R67p,_DIFFOUT_R67p,_DQ6R)) H20(IO,_(DIFFIO_RX_R67n,_DIFFOUT_R67n,_DQ6R)) H22(IO,_(DIFFIO_RX_R55p,_DIFFOUT_R55p,_DQ5R)) H23(IO,_(DIFFIO_TX_R54p,_DIFFOUT_R54p)) H24(IO,_(DIFFIO_TX_R54n,_DIFFOUT_R54n,_DQ5R)) H25(IO,_(DIFFIO_TX_R46n,_DIFFOUT_R46n,_DQ4R)) J20(IO,_(DIFFIO_RX_R69p,_DIFFOUT_R69p,_DQS6R)) J21(IO,_(DIFFIO_RX_R69n,_DIFFOUT_R69n,_DQSn6R)) J23(IO,_(DIFFIO_RX_R55n,_DIFFOUT_R55n,_DQ5R)) J25(IO,_(DIFFIO_TX_R42p,_DIFFOUT_R42p,_DQ4R)) J26(IO,_(DIFFIO_TX_R42n,_DIFFOUT_R42n,_DQ4R)) K21(IO,_(DIFFIO_RX_R65n,_DIFFOUT_R65n)) K23(IO,_(DIFFIO_RX_R51n,_DIFFOUT_R51n,_DQ5R)) K24(IO,_(DIFFIO_RX_R51p,_DIFFOUT_R51p,_DQ5R)) K25(IO,_CLK4p,_FPLL_TR_FBp,_(DIFFIO_RX_R49p,_DIFFOUT_R49p)) K26(IO,_CLK4n,_FPLL_TR_FBn,_(DIFFIO_RX_R49n,_DIFFOUT_R49n)) L22(IO,_(DIFFIO_RX_R65p,_DIFFOUT_R65p)) L23(IO,_(DIFFIO_RX_R53p,_DIFFOUT_R53p,_DQS5R)) L24(IO,_(DIFFIO_RX_R53n,_DIFFOUT_R53n,_DQSn5R)) M21(IO,_CLK5n,_(DIFFIO_RX_R41n,_DIFFOUT_R41n)) M22(IO,_(DIFFIO_RX_R45n,_DIFFOUT_R45n,_DQSn4R)) M24(IO,_(DIFFIO_RX_R43n,_DIFFOUT_R43n,_DQ4R)) M25(IO,_(DIFFIO_RX_R47p,_DIFFOUT_R47p,_DQ4R)) M26(IO,_(DIFFIO_RX_R47n,_DIFFOUT_R47n,_DQ4R)) N20(IO,_CLK5p,_(DIFFIO_RX_R41p,_DIFFOUT_R41p)) N23(IO,_(DIFFIO_RX_R45p,_DIFFOUT_R45p,_DQS4R)) N24(IO,_(DIFFIO_RX_R43p,_DIFFOUT_R43p,_DQ4R)); U?#6 P20(IO,_CLK6n,_(DIFFIO_RX_R33n,_DIFFOUT_R33n)) R20(IO,_CLK6p,_(DIFFIO_RX_R33p,_DIFFOUT_R33p)) T21(IO,_CLK7p,_FPLL_BR_FBp,_(DIFFIO_RX_R25p,_DIFFOUT_R25p)) T22(IO,_CLK7n,_FPLL_BR_FBn,_(DIFFIO_RX_R25n,_DIFFOUT_R25n)) Y25(IO,_FPLL_BR_CLKOUT0,_FPLL_BR_CLKOUTp,_FPLL_BR_FB,_(DIFFIO_TX_R36p,_DIFFOUT_R36p,_DQ3R)) Y26(IO,_FPLL_BR_CLKOUT1,_FPLL_BR_CLKOUTn,_(DIFFIO_TX_R36n,_DIFFOUT_R36n,_DQ3R))

### Buses and harness runs
bus HDMI_TX_D[23..0]

### Layout directives
net class HDMI: HDMI_TX_D0, HDMI_TX_D1, HDMI_TX_D2, HDMI_TX_D3, HDMI_TX_D4, HDMI_TX_D5, HDMI_TX_D6, HDMI_TX_D7, HDMI_TX_D8, HDMI_TX_D9, HDMI_TX_D10, HDMI_TX_D11, HDMI_TX_D12, HDMI_TX_D13, HDMI_TX_D14, HDMI_TX_D15, HDMI_TX_D16, HDMI_TX_D17, HDMI_TX_D18, HDMI_TX_D19, HDMI_TX_D20, HDMI_TX_D21, HDMI_TX_D22, HDMI_TX_D23, HDMI_TX_HS, HDMI_TX_VS

### Notes on the sheet
- CYCLONE V GX Bank 5&6 ( HDMI, SRAM)
- HDMI Interface (7)
- (in symbol 5CGXFC7D7F27C8N, part D) BANK 5A
- (in symbol 5CGXFC7D7F27C8N, part E) BANK 5B
- (in symbol 5CGXFC7D7F27C8N, part F) BANK 6A

### Library data of the parts
U?#4-U?#6 = 5CGXFC7D7F27C8N: as U?#1 on sheet Sheet1; DatasheetVersion: Rev. 3.1; PackageReference: 672-FBGA-2000A; PackageDescription: 672-Pin FineLine Ball-Grid Array (FBGA), Body 27 x 27 mm, Pitch 1 mm; Supplier 1: Digi-Key; Supplier Part Number 1: 544-2773-ND; Supplier 2: Mouser; Supplier Part Number 2: 989-5CGXFC7D7F27C8N; Device Group: 5CGXFC7; RoHS: RoHS Compliant; Subcategory: Cyclone V GX; Voltage Supply: 1.07 to 1.13 V; Mounting Technology: Surface Mount; Code_JEDEC: MS-034-AAL-1; PartNumber: 5CGXFC7D7F27C8N; ComponentLink1Description: Manufacturer URL; ComponentLink1URL: http://www.altera.com; ComponentLink2Description: Datasheet; ComponentLink2URL: http://www.altera.com/literature/hb/cyclone-v/cv_51002.pdf; ComponentLink3Description: Package Specification; ComponentLink3URL: http://www.altera.com/devicepackaging/04R00427-01.pdf; ComponentLink4Description: Device Handbook URL; ComponentLink4URL: http://www.altera.com/literature/hb/cyclone-v/cyclone5_handbook.pdf; ComponentLink5Description: Device Overview URL; ComponentLink5URL: http://www.altera.com/literature/hb/cyclone-v/cv_51001.pdf; ComponentLink6Description: Device Pin-Out URL; ComponentLink6URL: http://www.altera.com/literature/dp/cyclone-v/1.txt; ComponentLink7Description: Product URL; ComponentLink7URL: http://www.buyaltera.com/scripts/partsearch.dll?Detail&name=5CGXFC7D7F27C8N-ND

## Sheet Sheet3.SchDoc
size A3
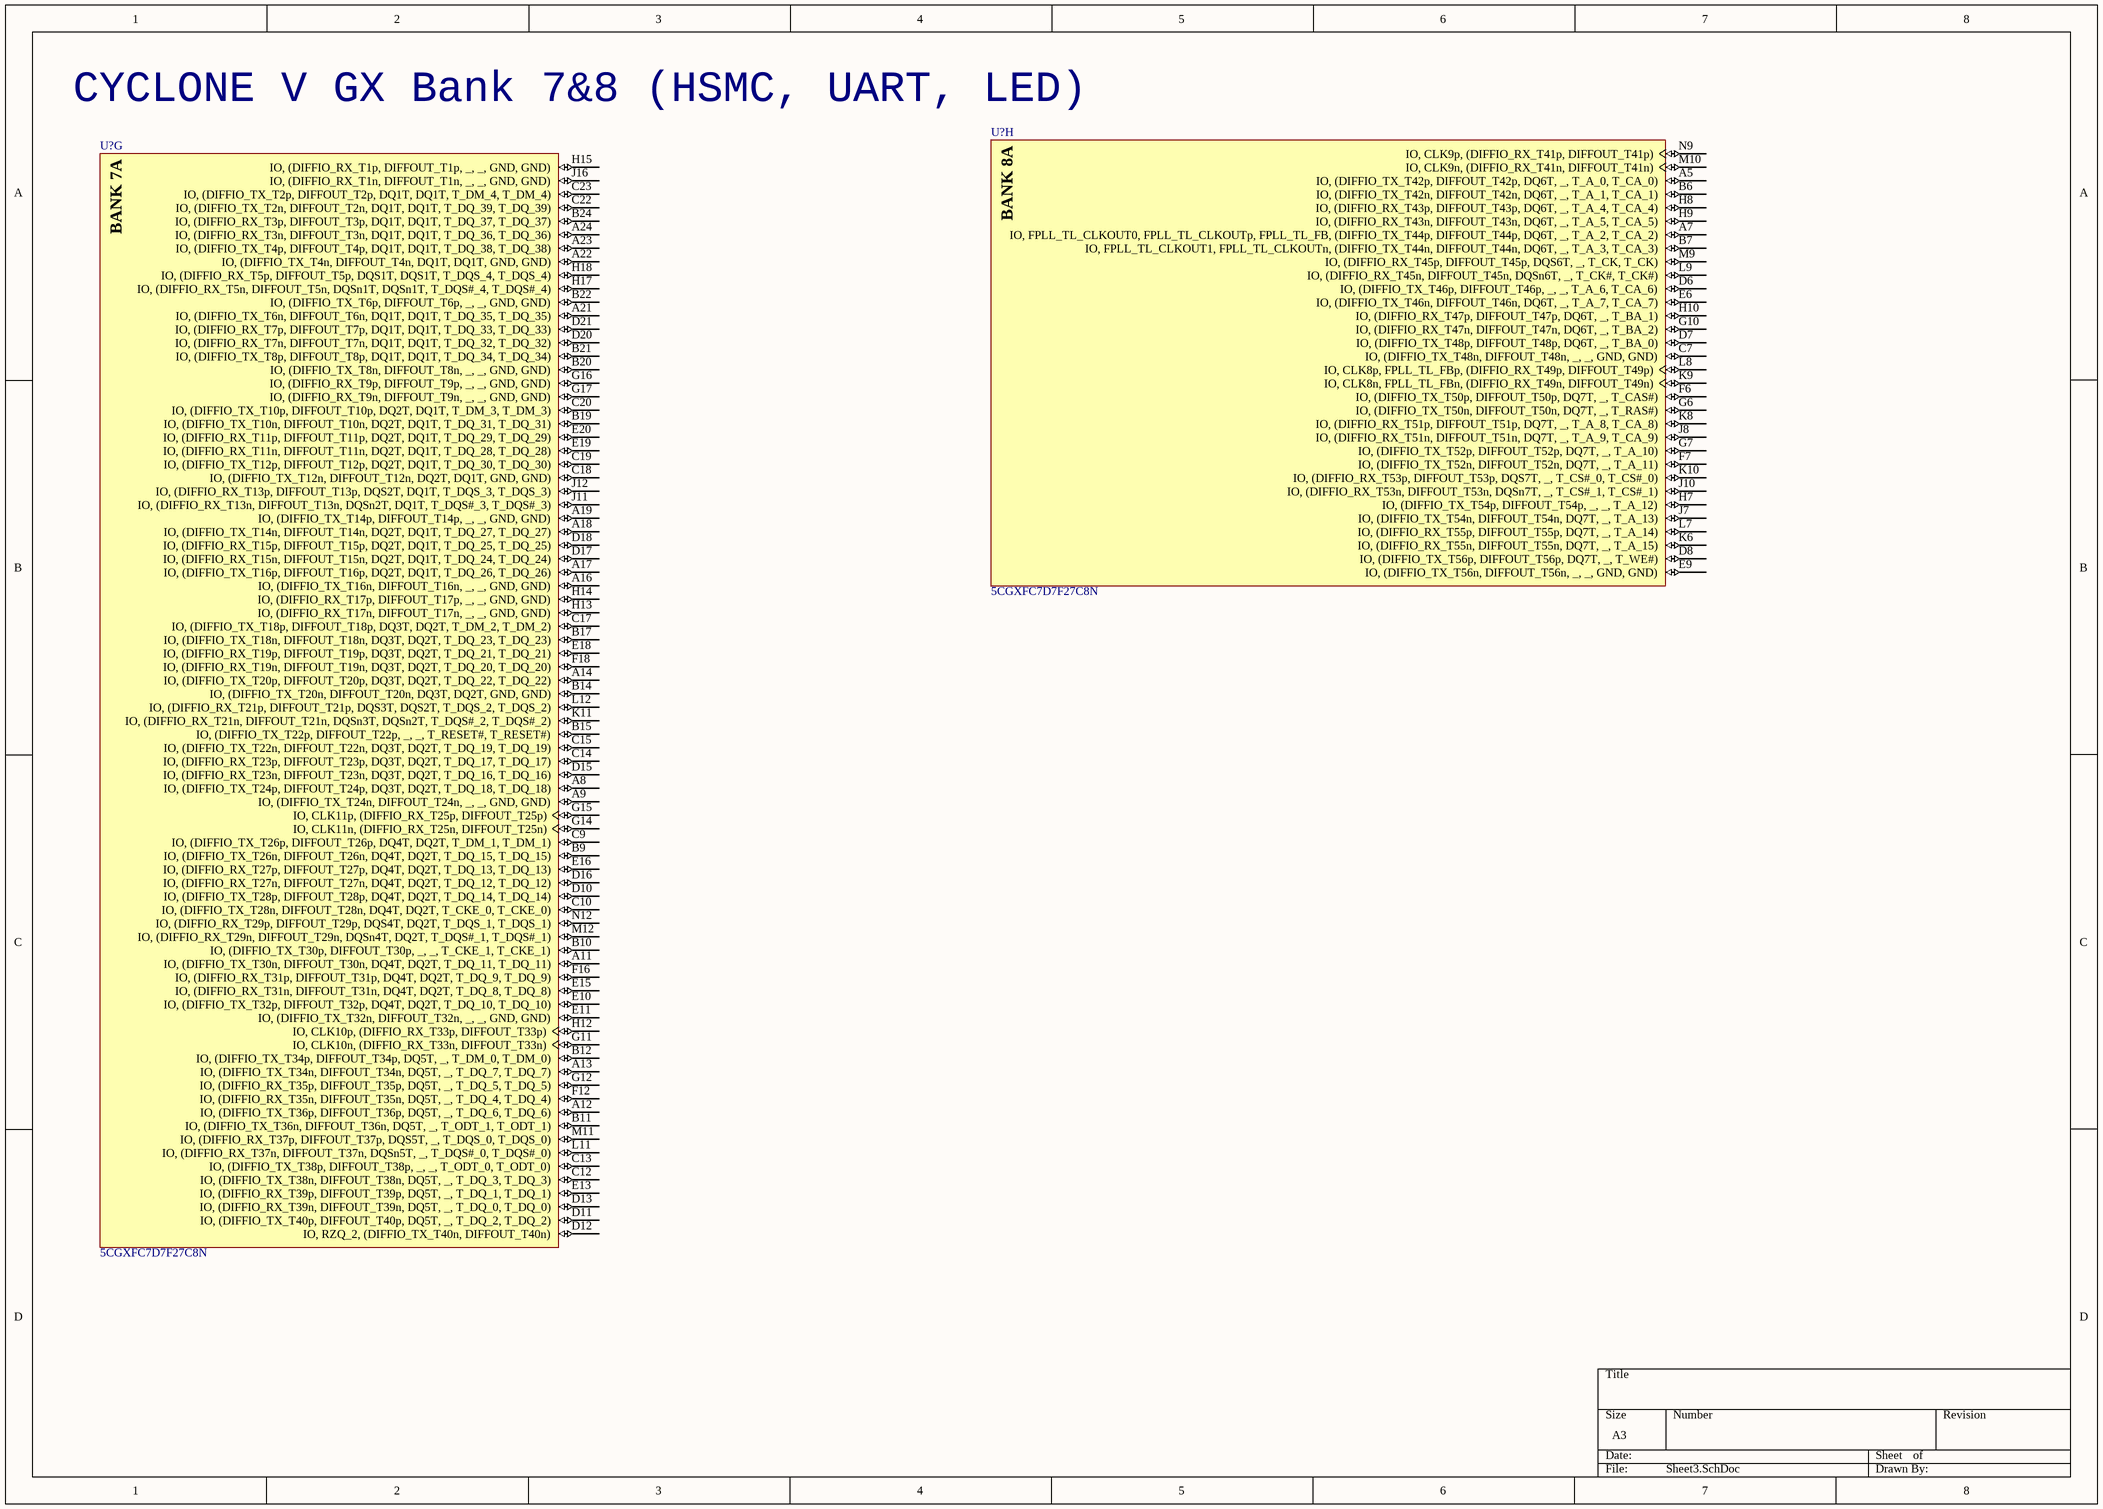
[diagram p2: Sheet3.SchDoc]

### Parts
(Parts that share a designator on the sheet are numbered #1, #2 ... from top to bottom, then left to right.)
U?#7  5CGXFC7D7F27C8N  [ALTR-672-FBGA-2000A]  (part H of 15)
U?#8  5CGXFC7D7F27C8N  [ALTR-672-FBGA-2000A]  (part G of 15)

### Nets

Not connected (* = marked no-connect by the designer): U?#7 A5(IO,_(DIFFIO_TX_T42p,_DIFFOUT_T42p,_DQ6T,__,_T_A_0,_T_CA_0)) A7(IO,_FPLL_TL_CLKOUT0,_FPLL_TL_CLKOUTp,_FPLL_TL_FB,_(DIFFIO_TX_T44p,_DIFFOUT_T44p,_DQ6T,__,_T_A_2,_T_CA_2)) B6(IO,_(DIFFIO_TX_T42n,_DIFFOUT_T42n,_DQ6T,__,_T_A_1,_T_CA_1)) B7(IO,_FPLL_TL_CLKOUT1,_FPLL_TL_CLKOUTn,_(DIFFIO_TX_T44n,_DIFFOUT_T44n,_DQ6T,__,_T_A_3,_T_CA_3)) C7(IO,_(DIFFIO_TX_T48n,_DIFFOUT_T48n,__,__,_GND,_GND)) D6(IO,_(DIFFIO_TX_T46p,_DIFFOUT_T46p,__,__,_T_A_6,_T_CA_6)) D7(IO,_(DIFFIO_TX_T48p,_DIFFOUT_T48p,_DQ6T,__,_T_BA_0)) D8(IO,_(DIFFIO_TX_T56p,_DIFFOUT_T56p,_DQ7T,__,_T_WE#)) E6(IO,_(DIFFIO_TX_T46n,_DIFFOUT_T46n,_DQ6T,__,_T_A_7,_T_CA_7)) E9(IO,_(DIFFIO_TX_T56n,_DIFFOUT_T56n,__,__,_GND,_GND)) F6(IO,_(DIFFIO_TX_T50p,_DIFFOUT_T50p,_DQ7T,__,_T_CAS#)) F7(IO,_(DIFFIO_TX_T52n,_DIFFOUT_T52n,_DQ7T,__,_T_A_11)) G6(IO,_(DIFFIO_TX_T50n,_DIFFOUT_T50n,_DQ7T,__,_T_RAS#)) G7(IO,_(DIFFIO_TX_T52p,_DIFFOUT_T52p,_DQ7T,__,_T_A_10)) G10(IO,_(DIFFIO_RX_T47n,_DIFFOUT_T47n,_DQ6T,__,_T_BA_2)) H7(IO,_(DIFFIO_TX_T54p,_DIFFOUT_T54p,__,__,_T_A_12)) H8(IO,_(DIFFIO_RX_T43p,_DIFFOUT_T43p,_DQ6T,__,_T_A_4,_T_CA_4)) H9(IO,_(DIFFIO_RX_T43n,_DIFFOUT_T43n,_DQ6T,__,_T_A_5,_T_CA_5)) H10(IO,_(DIFFIO_RX_T47p,_DIFFOUT_T47p,_DQ6T,__,_T_BA_1)) J7(IO,_(DIFFIO_TX_T54n,_DIFFOUT_T54n,_DQ7T,__,_T_A_13)) J8(IO,_(DIFFIO_RX_T51n,_DIFFOUT_T51n,_DQ7T,__,_T_A_9,_T_CA_9)) J10(IO,_(DIFFIO_RX_T53n,_DIFFOUT_T53n,_DQSn7T,__,_T_CS#_1,_T_CS#_1)) K6(IO,_(DIFFIO_RX_T55n,_DIFFOUT_T55n,_DQ7T,__,_T_A_15)) K8(IO,_(DIFFIO_RX_T51p,_DIFFOUT_T51p,_DQ7T,__,_T_A_8,_T_CA_8)) K9(IO,_CLK8n,_FPLL_TL_FBn,_(DIFFIO_RX_T49n,_DIFFOUT_T49n)) K10(IO,_(DIFFIO_RX_T53p,_DIFFOUT_T53p,_DQS7T,__,_T_CS#_0,_T_CS#_0)) L7(IO,_(DIFFIO_RX_T55p,_DIFFOUT_T55p,_DQ7T,__,_T_A_14)) L8(IO,_CLK8p,_FPLL_TL_FBp,_(DIFFIO_RX_T49p,_DIFFOUT_T49p)) L9(IO,_(DIFFIO_RX_T45n,_DIFFOUT_T45n,_DQSn6T,__,_T_CK#,_T_CK#)) M9(IO,_(DIFFIO_RX_T45p,_DIFFOUT_T45p,_DQS6T,__,_T_CK,_T_CK)) M10(IO,_CLK9n,_(DIFFIO_RX_T41n,_DIFFOUT_T41n)) N9(IO,_CLK9p,_(DIFFIO_RX_T41p,_DIFFOUT_T41p)); U?#8 A8(IO,_(DIFFIO_TX_T24p,_DIFFOUT_T24p,_DQ3T,_DQ2T,_T_DQ_18,_T_DQ_18)) A9(IO,_(DIFFIO_TX_T24n,_DIFFOUT_T24n,__,__,_GND,_GND)) A11(IO,_(DIFFIO_TX_T30n,_DIFFOUT_T30n,_DQ4T,_DQ2T,_T_DQ_11,_T_DQ_11)) A12(IO,_(DIFFIO_TX_T36p,_DIFFOUT_T36p,_DQ5T,__,_T_DQ_6,_T_DQ_6)) A13(IO,_(DIFFIO_TX_T34n,_DIFFOUT_T34n,_DQ5T,__,_T_DQ_7,_T_DQ_7)) A14(IO,_(DIFFIO_TX_T20p,_DIFFOUT_T20p,_DQ3T,_DQ2T,_T_DQ_22,_T_DQ_22)) A16(IO,_(DIFFIO_TX_T16n,_DIFFOUT_T16n,__,__,_GND,_GND)) A17(IO,_(DIFFIO_TX_T16p,_DIFFOUT_T16p,_DQ2T,_DQ1T,_T_DQ_26,_T_DQ_26)) A18(IO,_(DIFFIO_TX_T14n,_DIFFOUT_T14n,_DQ2T,_DQ1T,_T_DQ_27,_T_DQ_27)) A19(IO,_(DIFFIO_TX_T14p,_DIFFOUT_T14p,__,__,_GND,_GND)) A21(IO,_(DIFFIO_TX_T6n,_DIFFOUT_T6n,_DQ1T,_DQ1T,_T_DQ_35,_T_DQ_35)) A22(IO,_(DIFFIO_TX_T4n,_DIFFOUT_T4n,_DQ1T,_DQ1T,_GND,_GND)) A23(IO,_(DIFFIO_TX_T4p,_DIFFOUT_T4p,_DQ1T,_DQ1T,_T_DQ_38,_T_DQ_38)) A24(IO,_(DIFFIO_RX_T3n,_DIFFOUT_T3n,_DQ1T,_DQ1T,_T_DQ_36,_T_DQ_36)) B9(IO,_(DIFFIO_TX_T26n,_DIFFOUT_T26n,_DQ4T,_DQ2T,_T_DQ_15,_T_DQ_15)) B10(IO,_(DIFFIO_TX_T30p,_DIFFOUT_T30p,__,__,_T_CKE_1,_T_CKE_1)) B11(IO,_(DIFFIO_TX_T36n,_DIFFOUT_T36n,_DQ5T,__,_T_ODT_1,_T_ODT_1)) B12(IO,_(DIFFIO_TX_T34p,_DIFFOUT_T34p,_DQ5T,__,_T_DM_0,_T_DM_0)) B14(IO,_(DIFFIO_TX_T20n,_DIFFOUT_T20n,_DQ3T,_DQ2T,_GND,_GND)) B15(IO,_(DIFFIO_TX_T22p,_DIFFOUT_T22p,__,__,_T_RESET#,_T_RESET#)) B17(IO,_(DIFFIO_TX_T18n,_DIFFOUT_T18n,_DQ3T,_DQ2T,_T_DQ_23,_T_DQ_23)) B19(IO,_(DIFFIO_TX_T10n,_DIFFOUT_T10n,_DQ2T,_DQ1T,_T_DQ_31,_T_DQ_31)) B20(IO,_(DIFFIO_TX_T8n,_DIFFOUT_T8n,__,__,_GND,_GND)) B21(IO,_(DIFFIO_TX_T8p,_DIFFOUT_T8p,_DQ1T,_DQ1T,_T_DQ_34,_T_DQ_34)) B22(IO,_(DIFFIO_TX_T6p,_DIFFOUT_T6p,__,__,_GND,_GND)) B24(IO,_(DIFFIO_RX_T3p,_DIFFOUT_T3p,_DQ1T,_DQ1T,_T_DQ_37,_T_DQ_37)) C9(IO,_(DIFFIO_TX_T26p,_DIFFOUT_T26p,_DQ4T,_DQ2T,_T_DM_1,_T_DM_1)) C10(IO,_(DIFFIO_TX_T28n,_DIFFOUT_T28n,_DQ4T,_DQ2T,_T_CKE_0,_T_CKE_0)) C12(IO,_(DIFFIO_TX_T38n,_DIFFOUT_T38n,_DQ5T,__,_T_DQ_3,_T_DQ_3)) C13(IO,_(DIFFIO_TX_T38p,_DIFFOUT_T38p,__,__,_T_ODT_0,_T_ODT_0)) C14(IO,_(DIFFIO_RX_T23p,_DIFFOUT_T23p,_DQ3T,_DQ2T,_T_DQ_17,_T_DQ_17)) C15(IO,_(DIFFIO_TX_T22n,_DIFFOUT_T22n,_DQ3T,_DQ2T,_T_DQ_19,_T_DQ_19)) C17(IO,_(DIFFIO_TX_T18p,_DIFFOUT_T18p,_DQ3T,_DQ2T,_T_DM_2,_T_DM_2)) C18(IO,_(DIFFIO_TX_T12n,_DIFFOUT_T12n,_DQ2T,_DQ1T,_GND,_GND)) C19(IO,_(DIFFIO_TX_T12p,_DIFFOUT_T12p,_DQ2T,_DQ1T,_T_DQ_30,_T_DQ_30)) C20(IO,_(DIFFIO_TX_T10p,_DIFFOUT_T10p,_DQ2T,_DQ1T,_T_DM_3,_T_DM_3)) C22(IO,_(DIFFIO_TX_T2n,_DIFFOUT_T2n,_DQ1T,_DQ1T,_T_DQ_39,_T_DQ_39)) C23(IO,_(DIFFIO_TX_T2p,_DIFFOUT_T2p,_DQ1T,_DQ1T,_T_DM_4,_T_DM_4)) D10(IO,_(DIFFIO_TX_T28p,_DIFFOUT_T28p,_DQ4T,_DQ2T,_T_DQ_14,_T_DQ_14)) D11(IO,_(DIFFIO_TX_T40p,_DIFFOUT_T40p,_DQ5T,__,_T_DQ_2,_T_DQ_2)) D12(IO,_RZQ_2,_(DIFFIO_TX_T40n,_DIFFOUT_T40n)) D13(IO,_(DIFFIO_RX_T39n,_DIFFOUT_T39n,_DQ5T,__,_T_DQ_0,_T_DQ_0)) D15(IO,_(DIFFIO_RX_T23n,_DIFFOUT_T23n,_DQ3T,_DQ2T,_T_DQ_16,_T_DQ_16)) D16(IO,_(DIFFIO_RX_T27n,_DIFFOUT_T27n,_DQ4T,_DQ2T,_T_DQ_12,_T_DQ_12)) D17(IO,_(DIFFIO_RX_T15n,_DIFFOUT_T15n,_DQ2T,_DQ1T,_T_DQ_24,_T_DQ_24)) D18(IO,_(DIFFIO_RX_T15p,_DIFFOUT_T15p,_DQ2T,_DQ1T,_T_DQ_25,_T_DQ_25)) D20(IO,_(DIFFIO_RX_T7n,_DIFFOUT_T7n,_DQ1T,_DQ1T,_T_DQ_32,_T_DQ_32)) D21(IO,_(DIFFIO_RX_T7p,_DIFFOUT_T7p,_DQ1T,_DQ1T,_T_DQ_33,_T_DQ_33)) E10(IO,_(DIFFIO_TX_T32p,_DIFFOUT_T32p,_DQ4T,_DQ2T,_T_DQ_10,_T_DQ_10)) E11(IO,_(DIFFIO_TX_T32n,_DIFFOUT_T32n,__,__,_GND,_GND)) E13(IO,_(DIFFIO_RX_T39p,_DIFFOUT_T39p,_DQ5T,__,_T_DQ_1,_T_DQ_1)) E15(IO,_(DIFFIO_RX_T31n,_DIFFOUT_T31n,_DQ4T,_DQ2T,_T_DQ_8,_T_DQ_8)) E16(IO,_(DIFFIO_RX_T27p,_DIFFOUT_T27p,_DQ4T,_DQ2T,_T_DQ_13,_T_DQ_13)) E18(IO,_(DIFFIO_RX_T19p,_DIFFOUT_T19p,_DQ3T,_DQ2T,_T_DQ_21,_T_DQ_21)) E19(IO,_(DIFFIO_RX_T11n,_DIFFOUT_T11n,_DQ2T,_DQ1T,_T_DQ_28,_T_DQ_28)) E20(IO,_(DIFFIO_RX_T11p,_DIFFOUT_T11p,_DQ2T,_DQ1T,_T_DQ_29,_T_DQ_29)) F12(IO,_(DIFFIO_RX_T35n,_DIFFOUT_T35n,_DQ5T,__,_T_DQ_4,_T_DQ_4)) F16(IO,_(DIFFIO_RX_T31p,_DIFFOUT_T31p,_DQ4T,_DQ2T,_T_DQ_9,_T_DQ_9)) F18(IO,_(DIFFIO_RX_T19n,_DIFFOUT_T19n,_DQ3T,_DQ2T,_T_DQ_20,_T_DQ_20)) G11(IO,_CLK10n,_(DIFFIO_RX_T33n,_DIFFOUT_T33n)) G12(IO,_(DIFFIO_RX_T35p,_DIFFOUT_T35p,_DQ5T,__,_T_DQ_5,_T_DQ_5)) G14(IO,_CLK11n,_(DIFFIO_RX_T25n,_DIFFOUT_T25n)) G15(IO,_CLK11p,_(DIFFIO_RX_T25p,_DIFFOUT_T25p)) G16(IO,_(DIFFIO_RX_T9p,_DIFFOUT_T9p,__,__,_GND,_GND)) G17(IO,_(DIFFIO_RX_T9n,_DIFFOUT_T9n,__,__,_GND,_GND)) H12(IO,_CLK10p,_(DIFFIO_RX_T33p,_DIFFOUT_T33p)) H13(IO,_(DIFFIO_RX_T17n,_DIFFOUT_T17n,__,__,_GND,_GND)) H14(IO,_(DIFFIO_RX_T17p,_DIFFOUT_T17p,__,__,_GND,_GND)) H15(IO,_(DIFFIO_RX_T1p,_DIFFOUT_T1p,__,__,_GND,_GND)) H17(IO,_(DIFFIO_RX_T5n,_DIFFOUT_T5n,_DQSn1T,_DQSn1T,_T_DQS#_4,_T_DQS#_4)) H18(IO,_(DIFFIO_RX_T5p,_DIFFOUT_T5p,_DQS1T,_DQS1T,_T_DQS_4,_T_DQS_4)) J11(IO,_(DIFFIO_RX_T13n,_DIFFOUT_T13n,_DQSn2T,_DQ1T,_T_DQS#_3,_T_DQS#_3)) J12(IO,_(DIFFIO_RX_T13p,_DIFFOUT_T13p,_DQS2T,_DQ1T,_T_DQS_3,_T_DQS_3)) J16(IO,_(DIFFIO_RX_T1n,_DIFFOUT_T1n,__,__,_GND,_GND)) K11(IO,_(DIFFIO_RX_T21n,_DIFFOUT_T21n,_DQSn3T,_DQSn2T,_T_DQS#_2,_T_DQS#_2)) L11(IO,_(DIFFIO_RX_T37n,_DIFFOUT_T37n,_DQSn5T,__,_T_DQS#_0,_T_DQS#_0)) L12(IO,_(DIFFIO_RX_T21p,_DIFFOUT_T21p,_DQS3T,_DQS2T,_T_DQS_2,_T_DQS_2)) M11(IO,_(DIFFIO_RX_T37p,_DIFFOUT_T37p,_DQS5T,__,_T_DQS_0,_T_DQS_0)) M12(IO,_(DIFFIO_RX_T29n,_DIFFOUT_T29n,_DQSn4T,_DQ2T,_T_DQS#_1,_T_DQS#_1)) N12(IO,_(DIFFIO_RX_T29p,_DIFFOUT_T29p,_DQS4T,_DQ2T,_T_DQS_1,_T_DQS_1))

### Notes on the sheet
- CYCLONE V GX Bank 7&8 (HSMC, UART, LED)
- (in symbol 5CGXFC7D7F27C8N, part G) BANK 7A
- (in symbol 5CGXFC7D7F27C8N, part H) BANK 8A

### Library data of the parts
U?#7 U?#8 = 5CGXFC7D7F27C8N: as U?#1 on sheet Sheet1; DatasheetVersion: Rev. 3.1; PackageReference: 672-FBGA-2000A; PackageDescription: 672-Pin FineLine Ball-Grid Array (FBGA), Body 27 x 27 mm, Pitch 1 mm; Supplier 1: Digi-Key; Supplier Part Number 1: 544-2773-ND; Supplier 2: Mouser; Supplier Part Number 2: 989-5CGXFC7D7F27C8N; Device Group: 5CGXFC7; RoHS: RoHS Compliant; Subcategory: Cyclone V GX; Voltage Supply: 1.07 to 1.13 V; Mounting Technology: Surface Mount; Code_JEDEC: MS-034-AAL-1; PartNumber: 5CGXFC7D7F27C8N; ComponentLink1Description: Manufacturer URL; ComponentLink1URL: http://www.altera.com; ComponentLink2Description: Datasheet; ComponentLink2URL: http://www.altera.com/literature/hb/cyclone-v/cv_51002.pdf; ComponentLink3Description: Package Specification; ComponentLink3URL: http://www.altera.com/devicepackaging/04R00427-01.pdf; ComponentLink4Description: Device Handbook URL; ComponentLink4URL: http://www.altera.com/literature/hb/cyclone-v/cyclone5_handbook.pdf; ComponentLink5Description: Device Overview URL; ComponentLink5URL: http://www.altera.com/literature/hb/cyclone-v/cv_51001.pdf; ComponentLink6Description: Device Pin-Out URL; ComponentLink6URL: http://www.altera.com/literature/dp/cyclone-v/1.txt; ComponentLink7Description: Product URL; ComponentLink7URL: http://www.buyaltera.com/scripts/partsearch.dll?Detail&name=5CGXFC7D7F27C8N-ND

## Sheet Sheet4.SchDoc
size A3
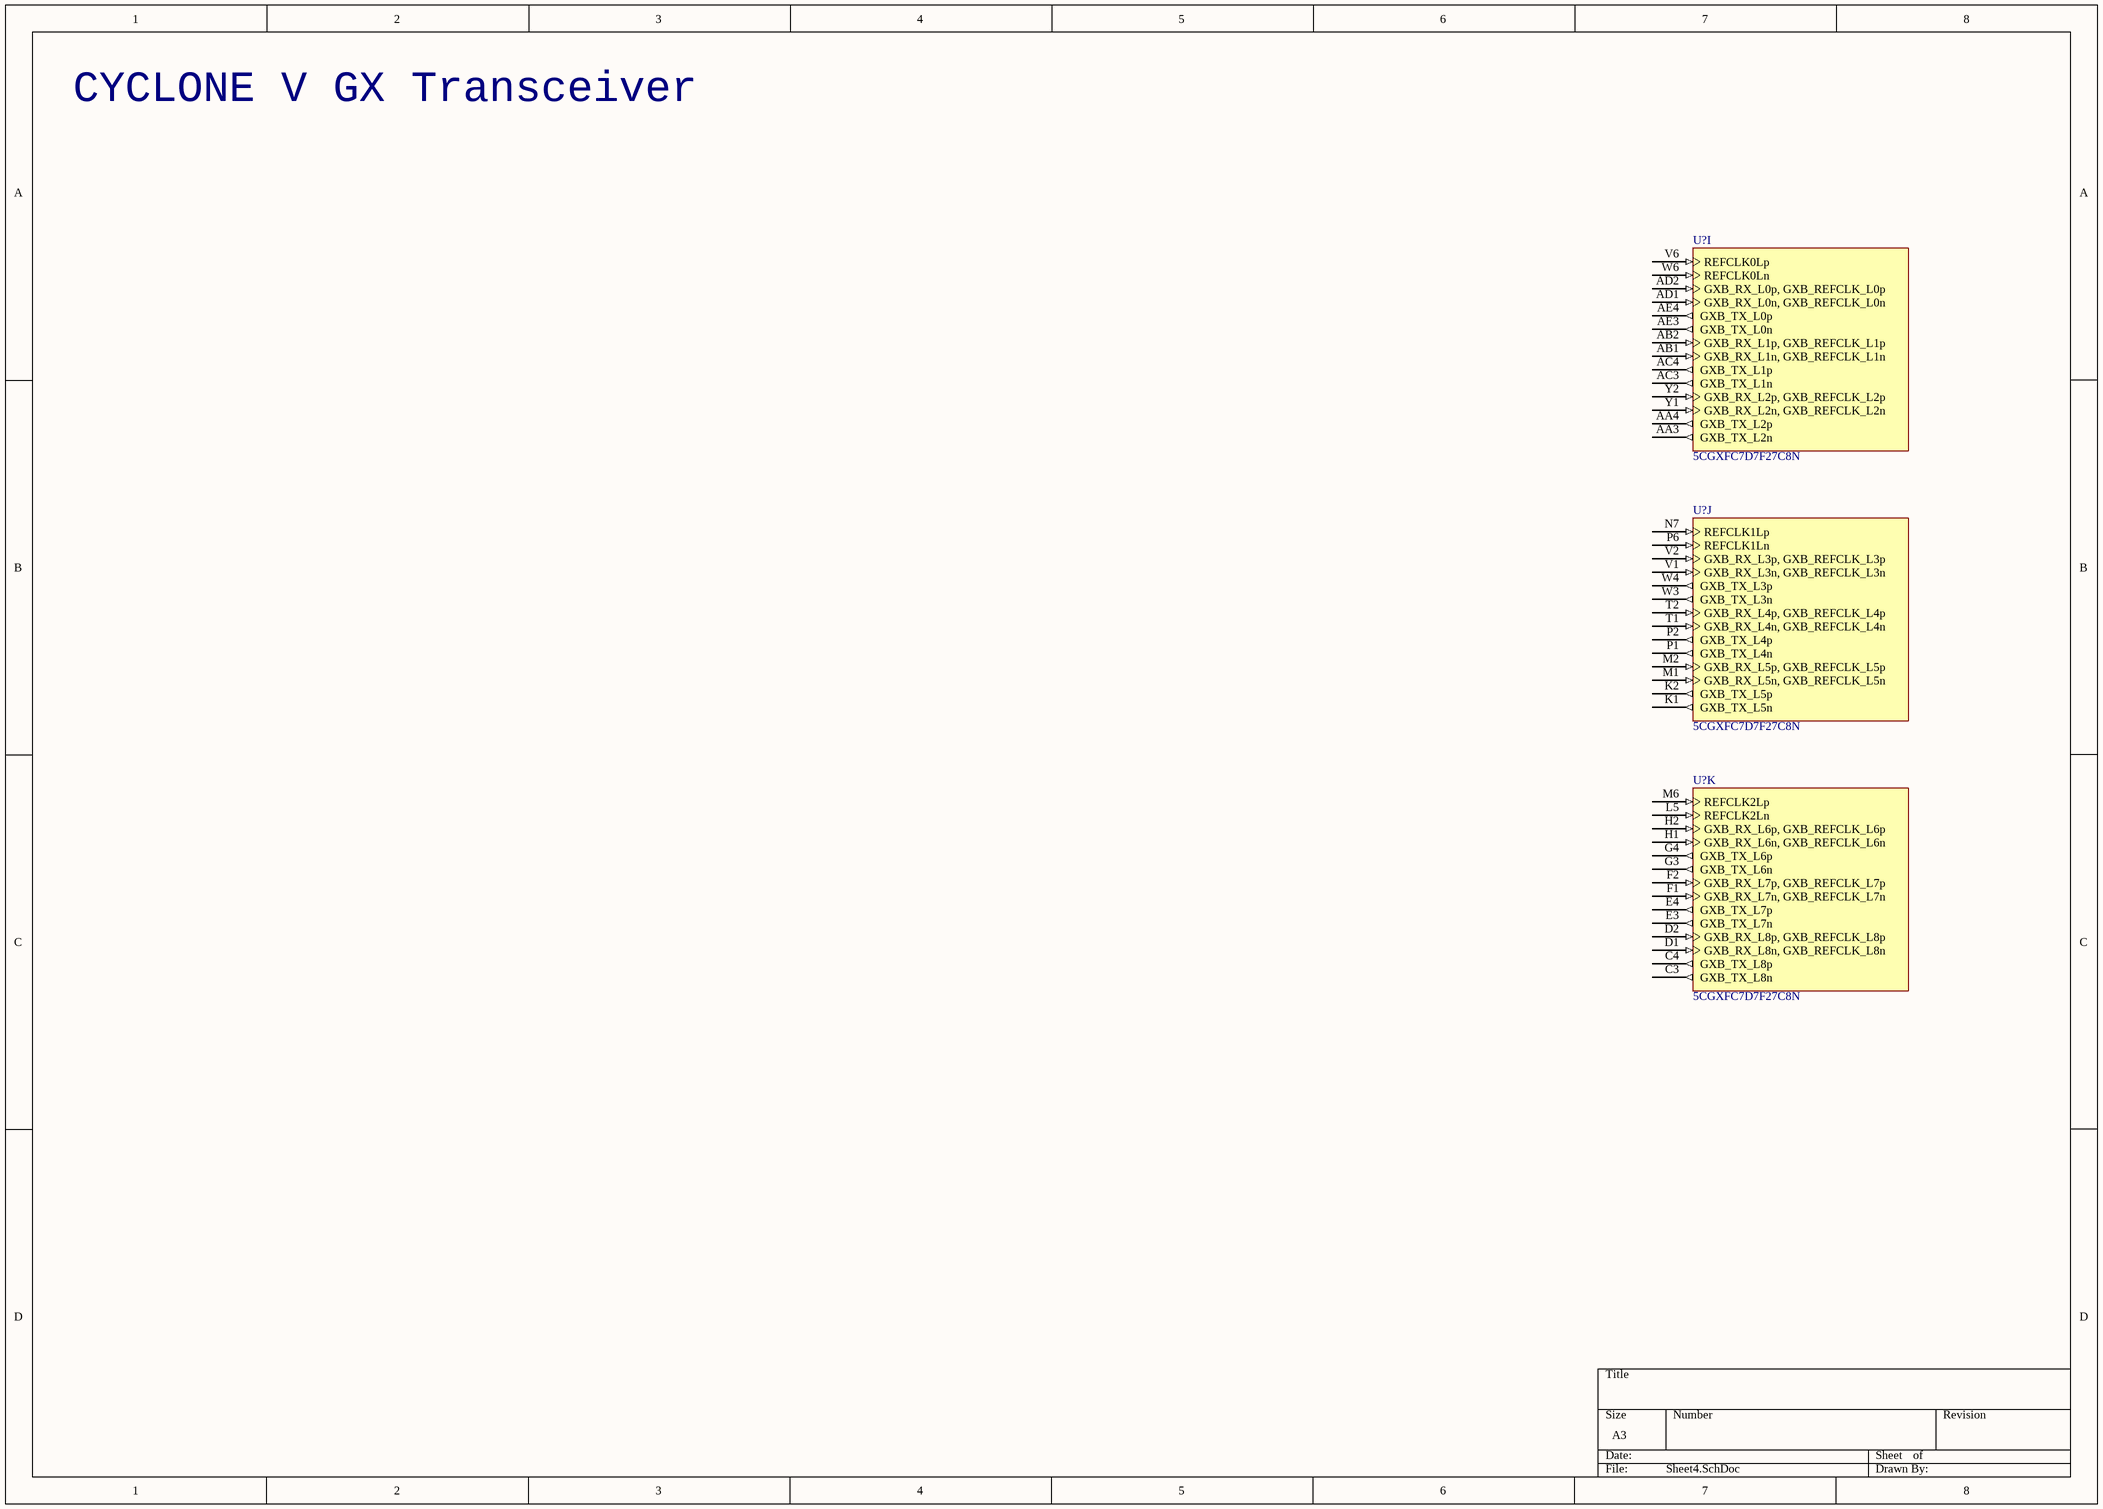
[diagram p3: Sheet4.SchDoc]

### Parts
(Parts that share a designator on the sheet are numbered #1, #2 ... from top to bottom, then left to right.)
U?#9  5CGXFC7D7F27C8N  [ALTR-672-FBGA-2000A]  (part I of 15)
U?#10  5CGXFC7D7F27C8N  [ALTR-672-FBGA-2000A]  (part J of 15)
U?#11  5CGXFC7D7F27C8N  [ALTR-672-FBGA-2000A]  (part K of 15)

### Nets

Not connected (* = marked no-connect by the designer): U?#9 AA3(GXB_TX_L2n) AA4(GXB_TX_L2p) AB1(GXB_RX_L1n,_GXB_REFCLK_L1n) AB2(GXB_RX_L1p,_GXB_REFCLK_L1p) AC3(GXB_TX_L1n) AC4(GXB_TX_L1p) AD1(GXB_RX_L0n,_GXB_REFCLK_L0n) AD2(GXB_RX_L0p,_GXB_REFCLK_L0p) AE3(GXB_TX_L0n) AE4(GXB_TX_L0p) V6(REFCLK0Lp) W6(REFCLK0Ln) Y1(GXB_RX_L2n,_GXB_REFCLK_L2n) Y2(GXB_RX_L2p,_GXB_REFCLK_L2p); U?#10 K1(GXB_TX_L5n) K2(GXB_TX_L5p) M1(GXB_RX_L5n,_GXB_REFCLK_L5n) M2(GXB_RX_L5p,_GXB_REFCLK_L5p) N7(REFCLK1Lp) P1(GXB_TX_L4n) P2(GXB_TX_L4p) P6(REFCLK1Ln) T1(GXB_RX_L4n,_GXB_REFCLK_L4n) T2(GXB_RX_L4p,_GXB_REFCLK_L4p) V1(GXB_RX_L3n,_GXB_REFCLK_L3n) V2(GXB_RX_L3p,_GXB_REFCLK_L3p) W3(GXB_TX_L3n) W4(GXB_TX_L3p); U?#11 C3(GXB_TX_L8n) C4(GXB_TX_L8p) D1(GXB_RX_L8n,_GXB_REFCLK_L8n) D2(GXB_RX_L8p,_GXB_REFCLK_L8p) E3(GXB_TX_L7n) E4(GXB_TX_L7p) F1(GXB_RX_L7n,_GXB_REFCLK_L7n) F2(GXB_RX_L7p,_GXB_REFCLK_L7p) G3(GXB_TX_L6n) G4(GXB_TX_L6p) H1(GXB_RX_L6n,_GXB_REFCLK_L6n) H2(GXB_RX_L6p,_GXB_REFCLK_L6p) L5(REFCLK2Ln) M6(REFCLK2Lp)

### Notes on the sheet
- CYCLONE V GX Transceiver

### Library data of the parts
U?#9-U?#11 = 5CGXFC7D7F27C8N: as U?#1 on sheet Sheet1; DatasheetVersion: Rev. 3.1; PackageReference: 672-FBGA-2000A; PackageDescription: 672-Pin FineLine Ball-Grid Array (FBGA), Body 27 x 27 mm, Pitch 1 mm; Supplier 1: Digi-Key; Supplier Part Number 1: 544-2773-ND; Supplier 2: Mouser; Supplier Part Number 2: 989-5CGXFC7D7F27C8N; Device Group: 5CGXFC7; RoHS: RoHS Compliant; Subcategory: Cyclone V GX; Voltage Supply: 1.07 to 1.13 V; Mounting Technology: Surface Mount; Code_JEDEC: MS-034-AAL-1; PartNumber: 5CGXFC7D7F27C8N; ComponentLink1Description: Manufacturer URL; ComponentLink1URL: http://www.altera.com; ComponentLink2Description: Datasheet; ComponentLink2URL: http://www.altera.com/literature/hb/cyclone-v/cv_51002.pdf; ComponentLink3Description: Package Specification; ComponentLink3URL: http://www.altera.com/devicepackaging/04R00427-01.pdf; ComponentLink4Description: Device Handbook URL; ComponentLink4URL: http://www.altera.com/literature/hb/cyclone-v/cyclone5_handbook.pdf; ComponentLink5Description: Device Overview URL; ComponentLink5URL: http://www.altera.com/literature/hb/cyclone-v/cv_51001.pdf; ComponentLink6Description: Device Pin-Out URL; ComponentLink6URL: http://www.altera.com/literature/dp/cyclone-v/1.txt; ComponentLink7Description: Product URL; ComponentLink7URL: http://www.buyaltera.com/scripts/partsearch.dll?Detail&name=5CGXFC7D7F27C8N-ND

## Sheet Sheet5.SchDoc
size A3
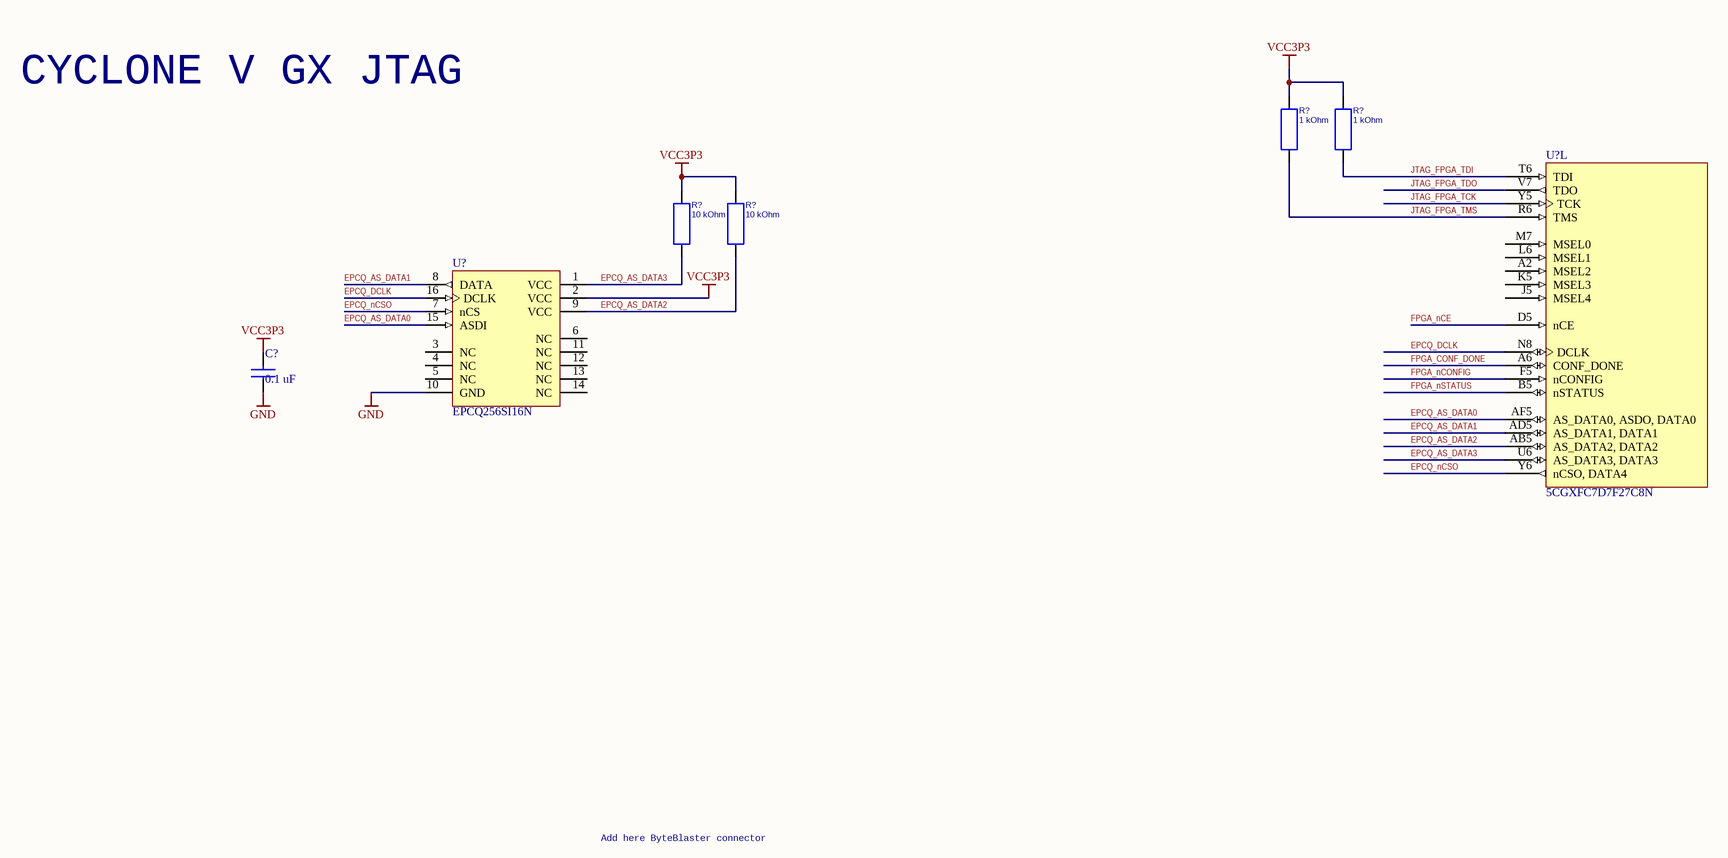
[diagram p4: Sheet5.SchDoc]

### Parts
(Parts that share a designator on the sheet are numbered #1, #2 ... from top to bottom, then left to right.)
C?#1  0.1 uF  [CAPC1608N]
R?#2  1 kOhm  [RESC1608N]
R?#3  1 kOhm  [RESC1608N]
R?#4  10 kOhm  [RESC1608N]
R?#5  10 kOhm  [RESC1608N]
U?#12  5CGXFC7D7F27C8N  [ALTR-672-FBGA-2000A]  (part L of 15)
U?#13  EPCQ256SI16N  [SOIC16_L]

### Nets
GND: C?#1.1 U?#13.10(GND)
VCC3P3: C?#1.2 R?#2.2 R?#3.2 R?#4.2 R?#5.2 U?#13.2(VCC)
EPCQ_AS_DATA0: U?#12.AF5(AS_DATA0,_ASDO,_DATA0) U?#13.15(ASDI)
EPCQ_AS_DATA1: U?#12.AD5(AS_DATA1,_DATA1) U?#13.8(DATA)
EPCQ_AS_DATA2: R?#5.1 U?#12.AB5(AS_DATA2,_DATA2) U?#13.9(VCC)
EPCQ_AS_DATA3: R?#4.1 U?#12.U6(AS_DATA3,_DATA3) U?#13.1(VCC)
EPCQ_DCLK: U?#12.N8(DCLK) U?#13.16(DCLK)
EPCQ_nCSO: U?#12.Y6(nCSO,_DATA4) U?#13.7(nCS)
FPGA_CONF_DONE: U?#12.A6(CONF_DONE)
FPGA_nCE: U?#12.D5(nCE)
FPGA_nCONFIG: U?#12.F5(nCONFIG)
FPGA_nSTATUS: U?#12.B5(nSTATUS)
JTAG_FPGA_TCK: U?#12.Y5(TCK)
JTAG_FPGA_TDI: R?#3.1 U?#12.T6(TDI)
JTAG_FPGA_TDO: U?#12.V7(TDO)
JTAG_FPGA_TMS: R?#2.1 U?#12.R6(TMS)

Not connected (* = marked no-connect by the designer): U?#12 A2(MSEL2) J5(MSEL4) K5(MSEL3) L6(MSEL1) M7(MSEL0); U?#13 3(NC) 4(NC) 5(NC) 6(NC) 11(NC) 12(NC) 13(NC) 14(NC)

### Notes on the sheet
- CYCLONE V GX JTAG
- Add here ByteBlaster connector

### Library data of the parts
C?#1 = CC0603: Vendor: DigiKey; Oper. Temp. Range: -55C to 85C; RoHS: Yes; Package: 0603
R?#2-R?#5 = RC0603: Oper. Temp. Range: -55C to 125C; RoHS: Yes; Package: 0603
U?#12 = 5CGXFC7D7F27C8N: as U?#1 on sheet Sheet1; DatasheetVersion: Rev. 3.1; PackageReference: 672-FBGA-2000A; PackageDescription: 672-Pin FineLine Ball-Grid Array (FBGA), Body 27 x 27 mm, Pitch 1 mm; Supplier 1: Digi-Key; Supplier Part Number 1: 544-2773-ND; Supplier 2: Mouser; Supplier Part Number 2: 989-5CGXFC7D7F27C8N; Device Group: 5CGXFC7; RoHS: RoHS Compliant; Subcategory: Cyclone V GX; Voltage Supply: 1.07 to 1.13 V; Mounting Technology: Surface Mount; Code_JEDEC: MS-034-AAL-1; PartNumber: 5CGXFC7D7F27C8N; ComponentLink1Description: Manufacturer URL; ComponentLink1URL: http://www.altera.com; ComponentLink2Description: Datasheet; ComponentLink2URL: http://www.altera.com/literature/hb/cyclone-v/cv_51002.pdf; ComponentLink3Description: Package Specification; ComponentLink3URL: http://www.altera.com/devicepackaging/04R00427-01.pdf; ComponentLink4Description: Device Handbook URL; ComponentLink4URL: http://www.altera.com/literature/hb/cyclone-v/cyclone5_handbook.pdf; ComponentLink5Description: Device Overview URL; ComponentLink5URL: http://www.altera.com/literature/hb/cyclone-v/cv_51001.pdf; ComponentLink6Description: Device Pin-Out URL; ComponentLink6URL: http://www.altera.com/literature/dp/cyclone-v/1.txt; ComponentLink7Description: Product URL; ComponentLink7URL: http://www.buyaltera.com/scripts/partsearch.dll?Detail&name=5CGXFC7D7F27C8N-ND
U?#13 = EPCQ256SI16N: EPCQ256 Series, In-system programmable 3.3V serial configuration device, 16-Pin SOIC, 128-Megabit, Industrial Grade, Pb-Free; Configures: All Arria series, all Cyclone series and all Stratix series (except Stratix); DatasheetVersion: ver3.0, Dec-2009; PackageVersion: ver14.2, Oct-2005; PackageReference: SOIC16; PackageDescription: 16-Pin Small Outline Integrated Circuit Package (SOIC16); Code_JEDEC: MS-013-AA; Code_IPC: SOIC127P1030-16; ComponentLink1Description: Manufacturer URL; ComponentLink1URL: http://www.altera.com/; ComponentLink2Description: Configuration Handbook; ComponentLink2URL: http://www.altera.com/literature/hb/cfg/config_handbook.pdf; ComponentLink3Description: Pinout; ComponentLink3URL: http://www.altera.com/literature/hb/cfg/config_handbook.pdf; ComponentLink4Description: Package Specification; ComponentLink4URL: http://www.altera.com/support/devices/packaging/specifications/pkg-pin/pdf/016-SOIC.pdf

## Sheet Sheet6.SchDoc
size A3; PageSetup: Record=PageOptions|CenterHorizontal=True|CenterVertical=True|PrintScale=1.00|XCorrection=1.00|YCorrection=1.00|PrintKind=0|BorderSize=5000000|LeftOffset=0|BottomOffset=0|Orientation=2|PaperLength=1000|PaperWidth=1000|Scale=100|PaperSource=7|PrintQuality=-3|MediaType=1|DitherType=10|PrintScaleMode=1|PaperKind=A3|PaperIndex=8
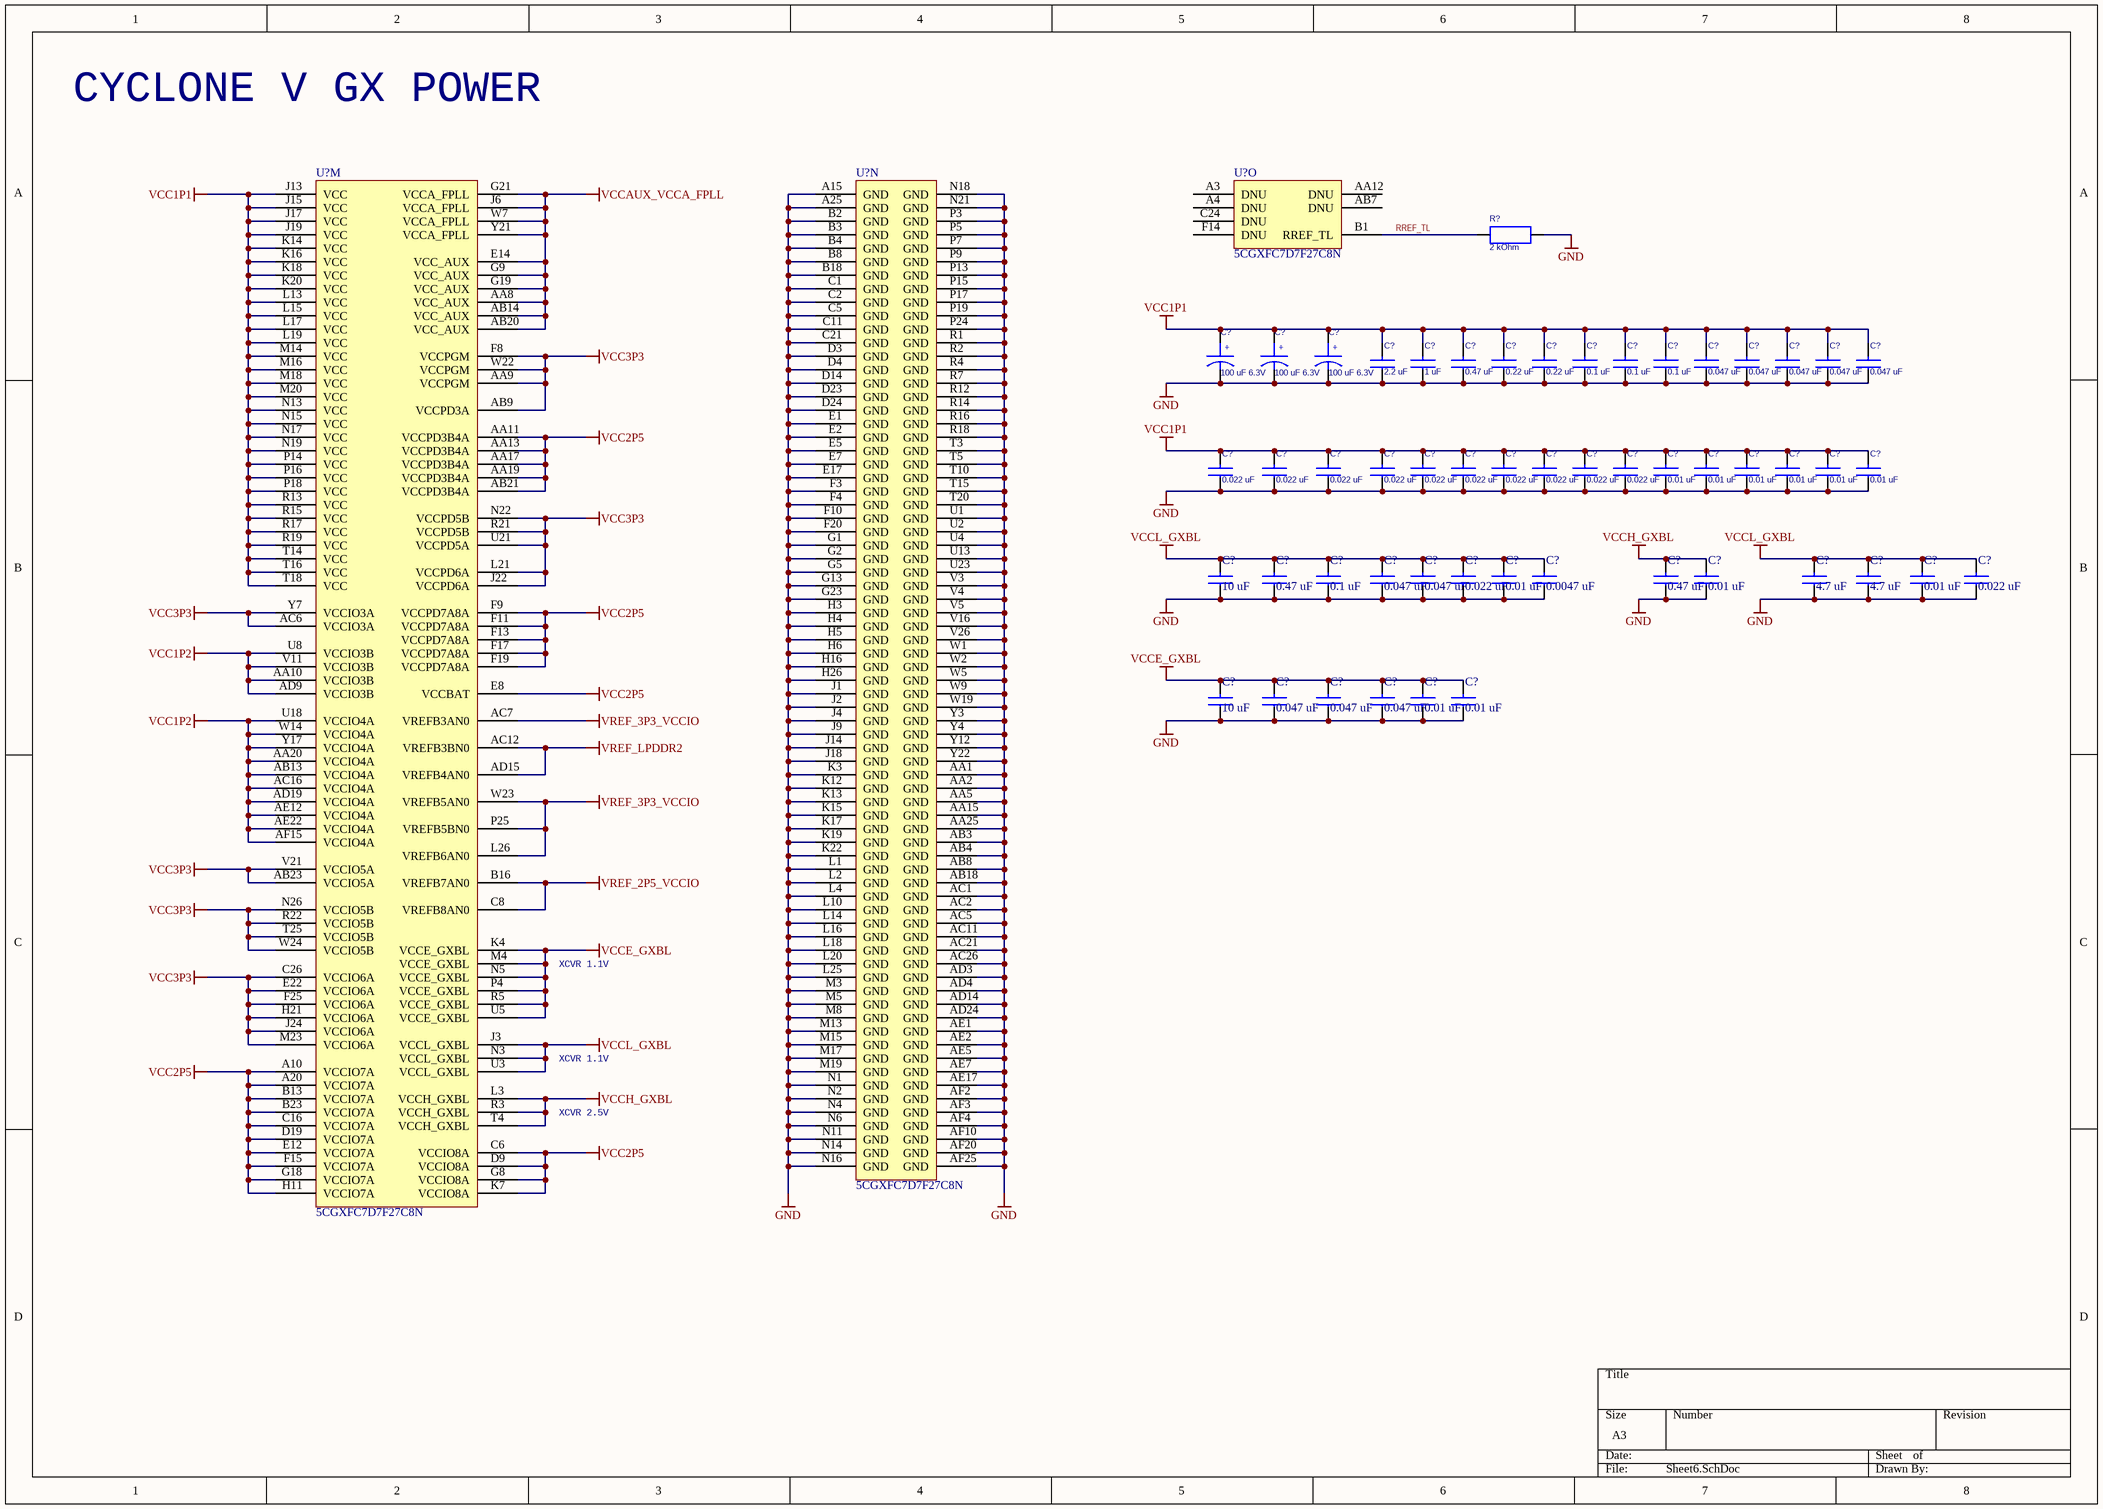
[diagram p5: Sheet6.SchDoc]

### Parts
(Parts that share a designator on the sheet are numbered #1, #2 ... from top to bottom, then left to right.)
C?#2  100 uF 6.3V  [TC3528-1411]
C?#3  100 uF 6.3V  [TC3528-1411]
C?#4  100 uF 6.3V  [TC3528-1411]
C?#5  2.2 uF  [CAPC1608N]
C?#6  1 uF  [CAPC1608N]
C?#7  0.47 uF  [CAPC1608N]
C?#8  0.22 uF  [CAPC1608N]
C?#9  0.22 uF  [CAPC1608N]
C?#10  0.1 uF  [CAPC1608N]
C?#11  0.1 uF  [CAPC1608N]
C?#12  0.1 uF  [CAPC1608N]
C?#13  0.047 uF  [CAPC1608N]
C?#14  0.047 uF  [CAPC1608N]
C?#15  0.047 uF  [CAPC1608N]
C?#16  0.047 uF  [CAPC1608N]
C?#17  0.047 uF  [CAPC1608N]
C?#18  0.022 uF  [CAPC1608N]
C?#19  0.022 uF  [CAPC1608N]
C?#20  0.022 uF  [CAPC1608N]
C?#21  0.022 uF  [CAPC1608N]
C?#22  0.022 uF  [CAPC1608N]
C?#23  0.022 uF  [CAPC1608N]
C?#24  0.022 uF  [CAPC1608N]
C?#25  0.022 uF  [CAPC1608N]
C?#26  0.022 uF  [CAPC1608N]
C?#27  0.022 uF  [CAPC1608N]
C?#28  0.01 uF  [CAPC1608N]
C?#29  0.01 uF  [CAPC1608N]
C?#30  0.01 uF  [CAPC1608N]
C?#31  0.01 uF  [CAPC1608N]
C?#32  0.01 uF  [CAPC1608N]
C?#33  0.01 uF  [CAPC1608N]
C?#34  10 uF  [CAPC1608N]
C?#35  0.47 uF  [CAPC1608N]
C?#36  0.1 uF  [CAPC1608N]
C?#37  0.047 uF  [CAPC1608N]
C?#38  0.047 uF  [CAPC1608N]
C?#39  0.022 uF  [CAPC1608N]
C?#40  0.01 uF  [CAPC1608N]
C?#41  0.0047 uF  [CAPC1608N]
C?#42  0.47 uF  [CAPC1608N]
C?#43  0.01 uF  [CAPC1608N]
C?#44  4.7 uF  [CAPC1608N]
C?#45  4.7 uF  [CAPC1608N]
C?#46  0.01 uF  [CAPC1608N]
C?#47  0.022 uF  [CAPC1608N]
C?#48  10 uF  [CAPC1608N]
C?#49  0.047 uF  [CAPC1608N]
C?#50  0.047 uF  [CAPC1608N]
C?#51  0.047 uF  [CAPC1608N]
C?#52  0.01 uF  [CAPC1608N]
C?#53  0.01 uF  [CAPC1608N]
R?#6  2 kOhm  [RESC1608N]
U?#14  5CGXFC7D7F27C8N  [ALTR-672-FBGA-2000A]  (part M of 15)
U?#15  5CGXFC7D7F27C8N  [ALTR-672-FBGA-2000A]  (part N of 15)
U?#16  5CGXFC7D7F27C8N  [ALTR-672-FBGA-2000A]  (part O of 15)

### Nets
GND: C?#2.2(Negative) C?#3.2(Negative) C?#4.2(Negative) C?#5.1 C?#6.1 C?#7.1 C?#8.1 C?#9.1 C?#10.1 C?#11.1 C?#12.1 C?#13.1 C?#14.1 C?#15.1 C?#16.1 C?#17.1 C?#18.1 C?#19.1 C?#20.1 C?#21.1 C?#22.1 C?#23.1 C?#24.1 C?#25.1 C?#26.1 C?#27.1 C?#28.1 C?#29.1 C?#30.1 C?#31.1 C?#32.1 C?#33.1 C?#34.1 C?#35.1 C?#36.1 C?#37.1 C?#38.1 C?#39.1 C?#40.1 C?#41.1 C?#42.1 C?#43.1 C?#44.1 C?#45.1 C?#46.1 C?#47.1 C?#48.1 C?#49.1 C?#50.1 C?#51.1 C?#52.1 C?#53.1 R?#6.2 U?#15.A15(GND) U?#15.A25(GND) U?#15.AA1(GND) U?#15.AA2(GND) U?#15.AA5(GND) U?#15.AA15(GND) U?#15.AA25(GND) U?#15.AB3(GND) U?#15.AB4(GND) U?#15.AB8(GND) U?#15.AB18(GND) U?#15.AC1(GND) U?#15.AC2(GND) U?#15.AC5(GND) U?#15.AC11(GND) U?#15.AC21(GND) U?#15.AC26(GND) U?#15.AD3(GND) U?#15.AD4(GND) U?#15.AD14(GND) U?#15.AD24(GND) U?#15.AE1(GND) U?#15.AE2(GND) U?#15.AE5(GND) U?#15.AE7(GND) U?#15.AE17(GND) U?#15.AF2(GND) U?#15.AF3(GND) U?#15.AF4(GND) U?#15.AF10(GND) U?#15.AF20(GND) U?#15.AF25(GND) U?#15.B2(GND) U?#15.B3(GND) U?#15.B4(GND) U?#15.B8(GND) U?#15.B18(GND) U?#15.C1(GND) U?#15.C2(GND) U?#15.C5(GND) U?#15.C11(GND) U?#15.C21(GND) U?#15.D3(GND) U?#15.D4(GND) U?#15.D14(GND) U?#15.D23(GND) U?#15.D24(GND) U?#15.E1(GND) U?#15.E2(GND) U?#15.E5(GND) U?#15.E7(GND) U?#15.E17(GND) U?#15.F3(GND) U?#15.F4(GND) U?#15.F10(GND) U?#15.F20(GND) U?#15.G1(GND) U?#15.G2(GND) U?#15.G5(GND) U?#15.G13(GND) U?#15.G23(GND) U?#15.H3(GND) U?#15.H4(GND) U?#15.H5(GND) U?#15.H6(GND) U?#15.H16(GND) U?#15.H26(GND) U?#15.J1(GND) U?#15.J2(GND) U?#15.J4(GND) U?#15.J9(GND) U?#15.J14(GND) U?#15.J18(GND) U?#15.K3(GND) U?#15.K12(GND) U?#15.K13(GND) U?#15.K15(GND) U?#15.K17(GND) U?#15.K19(GND) U?#15.K22(GND) U?#15.L1(GND) U?#15.L2(GND) U?#15.L4(GND) U?#15.L10(GND) U?#15.L14(GND) U?#15.L16(GND) U?#15.L18(GND) U?#15.L20(GND) U?#15.L25(GND) U?#15.M3(GND) U?#15.M5(GND) U?#15.M8(GND) U?#15.M13(GND) U?#15.M15(GND) U?#15.M17(GND) U?#15.M19(GND) U?#15.N1(GND) U?#15.N2(GND) U?#15.N4(GND) U?#15.N6(GND) U?#15.N11(GND) U?#15.N14(GND) U?#15.N16(GND) U?#15.N18(GND) U?#15.N21(GND) U?#15.P3(GND) U?#15.P5(GND) U?#15.P7(GND) U?#15.P9(GND) U?#15.P13(GND) U?#15.P15(GND) U?#15.P17(GND) U?#15.P19(GND) U?#15.P24(GND) U?#15.R1(GND) U?#15.R2(GND) U?#15.R4(GND) U?#15.R7(GND) U?#15.R12(GND) U?#15.R14(GND) U?#15.R16(GND) U?#15.R18(GND) U?#15.T3(GND) U?#15.T5(GND) U?#15.T10(GND) U?#15.T15(GND) U?#15.T20(GND) U?#15.U1(GND) U?#15.U2(GND) U?#15.U4(GND) U?#15.U13(GND) U?#15.U23(GND) U?#15.V3(GND) U?#15.V4(GND) U?#15.V5(GND) U?#15.V16(GND) U?#15.V26(GND) U?#15.W1(GND) U?#15.W2(GND) U?#15.W5(GND) U?#15.W9(GND) U?#15.W19(GND) U?#15.Y3(GND) U?#15.Y4(GND) U?#15.Y12(GND) U?#15.Y22(GND)
VCC1P1: C?#2.1(Positive) C?#3.1(Positive) C?#4.1(Positive) C?#5.2 C?#6.2 C?#7.2 C?#8.2 C?#9.2 C?#10.2 C?#11.2 C?#12.2 C?#13.2 C?#14.2 C?#15.2 C?#16.2 C?#17.2 C?#18.2 C?#19.2 C?#20.2 C?#21.2 C?#22.2 C?#23.2 C?#24.2 C?#25.2 C?#26.2 C?#27.2 C?#28.2 C?#29.2 C?#30.2 C?#31.2 C?#32.2 C?#33.2 U?#14.J13(VCC) U?#14.J15(VCC) U?#14.J17(VCC) U?#14.J19(VCC) U?#14.K14(VCC) U?#14.K16(VCC) U?#14.K18(VCC) U?#14.K20(VCC) U?#14.L13(VCC) U?#14.L15(VCC) U?#14.L17(VCC) U?#14.L19(VCC) U?#14.M14(VCC) U?#14.M16(VCC) U?#14.M18(VCC) U?#14.M20(VCC) U?#14.N13(VCC) U?#14.N15(VCC) U?#14.N17(VCC) U?#14.N19(VCC) U?#14.P14(VCC) U?#14.P16(VCC) U?#14.P18(VCC) U?#14.R13(VCC) U?#14.R15(VCC) U?#14.R17(VCC) U?#14.R19(VCC) U?#14.T14(VCC) U?#14.T16(VCC) U?#14.T18(VCC)
VCC1P2: U?#14.AA10(VCCIO3B) U?#14.AA20(VCCIO4A) U?#14.AB13(VCCIO4A) U?#14.AC16(VCCIO4A) U?#14.AD9(VCCIO3B) U?#14.AD19(VCCIO4A) U?#14.AE12(VCCIO4A) U?#14.AE22(VCCIO4A) U?#14.AF15(VCCIO4A) U?#14.U8(VCCIO3B) U?#14.U18(VCCIO4A) U?#14.V11(VCCIO3B) U?#14.W14(VCCIO4A) U?#14.Y17(VCCIO4A)
VCC2P5: U?#14.A10(VCCIO7A) U?#14.A20(VCCIO7A) U?#14.AA11(VCCPD3B4A) U?#14.AA13(VCCPD3B4A) U?#14.AA17(VCCPD3B4A) U?#14.AA19(VCCPD3B4A) U?#14.AB21(VCCPD3B4A) U?#14.B13(VCCIO7A) U?#14.B23(VCCIO7A) U?#14.C6(VCCIO8A) U?#14.C16(VCCIO7A) U?#14.D9(VCCIO8A) U?#14.D19(VCCIO7A) U?#14.E8(VCCBAT) U?#14.E12(VCCIO7A) U?#14.F9(VCCPD7A8A) U?#14.F11(VCCPD7A8A) U?#14.F13(VCCPD7A8A) U?#14.F15(VCCIO7A) U?#14.F17(VCCPD7A8A) U?#14.F19(VCCPD7A8A) U?#14.G8(VCCIO8A) U?#14.G18(VCCIO7A) U?#14.H11(VCCIO7A) U?#14.K7(VCCIO8A)
VCC3P3: U?#14.AA9(VCCPGM) U?#14.AB9(VCCPD3A) U?#14.AB23(VCCIO5A) U?#14.AC6(VCCIO3A) U?#14.C26(VCCIO6A) U?#14.E22(VCCIO6A) U?#14.F8(VCCPGM) U?#14.F25(VCCIO6A) U?#14.H21(VCCIO6A) U?#14.J22(VCCPD6A) U?#14.J24(VCCIO6A) U?#14.L21(VCCPD6A) U?#14.M23(VCCIO6A) U?#14.N22(VCCPD5B) U?#14.N26(VCCIO5B) U?#14.R21(VCCPD5B) U?#14.R22(VCCIO5B) U?#14.T25(VCCIO5B) U?#14.U21(VCCPD5A) U?#14.V21(VCCIO5A) U?#14.W22(VCCPGM) U?#14.W24(VCCIO5B) U?#14.Y7(VCCIO3A)
VCCAUX_VCCA_FPLL: U?#14.AA8(VCC_AUX) U?#14.AB14(VCC_AUX) U?#14.AB20(VCC_AUX) U?#14.E14(VCC_AUX) U?#14.G9(VCC_AUX) U?#14.G19(VCC_AUX) U?#14.G21(VCCA_FPLL) U?#14.J6(VCCA_FPLL) U?#14.W7(VCCA_FPLL) U?#14.Y21(VCCA_FPLL)
VCCE_GXBL: C?#48.2 C?#49.2 C?#50.2 C?#51.2 C?#52.2 C?#53.2 U?#14.K4(VCCE_GXBL) U?#14.M4(VCCE_GXBL) U?#14.N5(VCCE_GXBL) U?#14.P4(VCCE_GXBL) U?#14.R5(VCCE_GXBL) U?#14.U5(VCCE_GXBL)
VCCH_GXBL: C?#42.2 C?#43.2 U?#14.L3(VCCH_GXBL) U?#14.R3(VCCH_GXBL) U?#14.T4(VCCH_GXBL)
VCCL_GXBL: C?#34.2 C?#35.2 C?#36.2 C?#37.2 C?#38.2 C?#39.2 C?#40.2 C?#41.2 C?#44.2 C?#45.2 C?#46.2 C?#47.2 U?#14.J3(VCCL_GXBL) U?#14.N3(VCCL_GXBL) U?#14.U3(VCCL_GXBL)
VREF_2P5_VCCIO: U?#14.B16(VREFB7AN0) U?#14.C8(VREFB8AN0)
VREF_3P3_VCCIO: U?#14.AC7(VREFB3AN0) U?#14.L26(VREFB6AN0) U?#14.P25(VREFB5BN0) U?#14.W23(VREFB5AN0)
VREF_LPDDR2: U?#14.AC12(VREFB3BN0) U?#14.AD15(VREFB4AN0)
RREF_TL: R?#6.1 U?#16.B1(RREF_TL)

Not connected (* = marked no-connect by the designer): U?#16 A3(DNU) A4(DNU) AA12(DNU) AB7(DNU) C24(DNU) F14(DNU)

### Notes on the sheet
- CYCLONE V GX POWER
- XCVR 1.1V
- XCVR 2.5V
- (in symbol CAP TANTAL CASE B) +

### Library data of the parts
C?#2-C?#4 = CAP TANTAL CASE B: Vendor Part#: 399-5279-1-ND; Mfg Part#: T491A336K010AT; Vendor: DigiKey; Mfg: Kemet; Oper. Temp. Range: -55C to 125C; RoHS: Yes; Package: 3216-18
C?#5-C?#53 = CC0603: as C?#1 on sheet Sheet5; RoHS: Yes; Package: 0603
R?#6 = RC0603: Oper. Temp. Range: -55C to 125C; RoHS: Yes; Package: 0603
U?#14-U?#16 = 5CGXFC7D7F27C8N: as U?#1 on sheet Sheet1; DatasheetVersion: Rev. 3.1; PackageReference: 672-FBGA-2000A; PackageDescription: 672-Pin FineLine Ball-Grid Array (FBGA), Body 27 x 27 mm, Pitch 1 mm; Supplier 1: Digi-Key; Supplier Part Number 1: 544-2773-ND; Supplier 2: Mouser; Supplier Part Number 2: 989-5CGXFC7D7F27C8N; Device Group: 5CGXFC7; RoHS: RoHS Compliant; Subcategory: Cyclone V GX; Voltage Supply: 1.07 to 1.13 V; Mounting Technology: Surface Mount; Code_JEDEC: MS-034-AAL-1; PartNumber: 5CGXFC7D7F27C8N; ComponentLink1Description: Manufacturer URL; ComponentLink1URL: http://www.altera.com; ComponentLink2Description: Datasheet; ComponentLink2URL: http://www.altera.com/literature/hb/cyclone-v/cv_51002.pdf; ComponentLink3Description: Package Specification; ComponentLink3URL: http://www.altera.com/devicepackaging/04R00427-01.pdf; ComponentLink4Description: Device Handbook URL; ComponentLink4URL: http://www.altera.com/literature/hb/cyclone-v/cyclone5_handbook.pdf; ComponentLink5Description: Device Overview URL; ComponentLink5URL: http://www.altera.com/literature/hb/cyclone-v/cv_51001.pdf; ComponentLink6Description: Device Pin-Out URL; ComponentLink6URL: http://www.altera.com/literature/dp/cyclone-v/1.txt; ComponentLink7Description: Product URL; ComponentLink7URL: http://www.buyaltera.com/scripts/partsearch.dll?Detail&name=5CGXFC7D7F27C8N-ND